# EAGLE design nixie_drive (EAGLE 9.4.2)

## Sheet 1 of 2
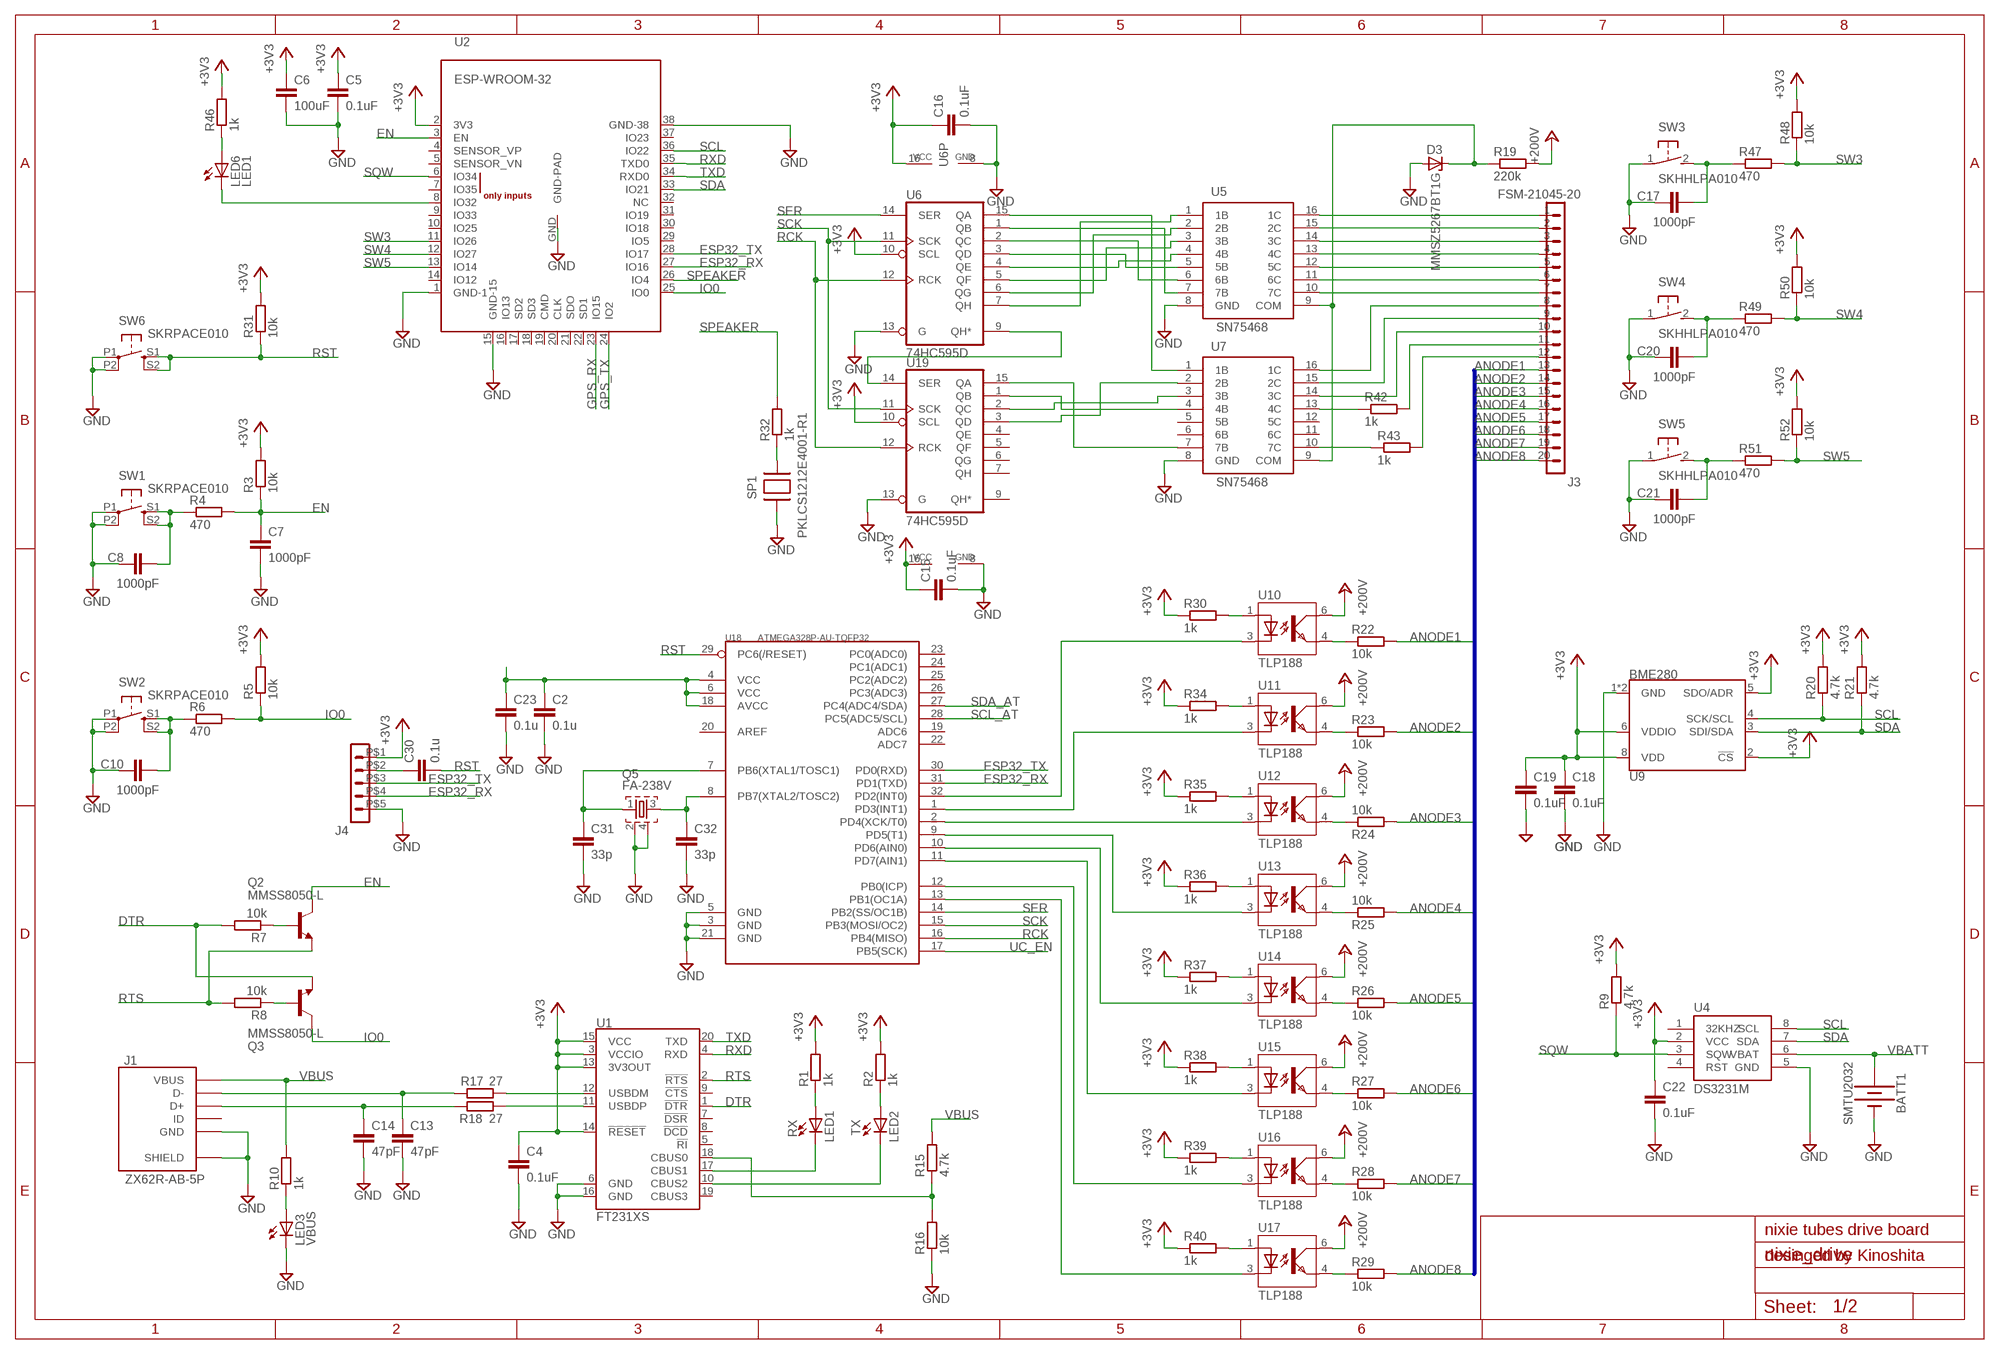
[diagram p0: schematic, sheet 1]

### Parts
BATT1  SMTU2032  [SMTU2032]
C2  0.1u  C-EUC0603  [C0603]
C4  0.1uF  C-EUC0603  [C0603]
C5  0.1uF  C-EUC0603  [C0603]
C6  100uF  C-EUC1210  [C1210]
C7  1000pF  C-EUC0603  [C0603]
C8  1000pF  C-EUC0603  [C0603]
C10  1000pF  C-EUC0603  [C0603]
C13  47pF  C-EUC0603  [C0603]
C14  47pF  C-EUC0603  [C0603]
C15  0.1uF  C-EUC0603  [C0603]
C16  0.1uF  C-EUC0603  [C0603]
C17  1000pF  C-EUC0603  [C0603]
C18  0.1uF  C-EUC0603  [C0603]
C19  0.1uF  C-EUC0603  [C0603]
C20  1000pF  C-EUC0603  [C0603]
C21  1000pF  C-EUC0603  [C0603]
C22  0.1uF  C-EUC0603  [C0603]
C23  0.1u  C-EUC0603  [C0603]
C30  0.1u  C-EUC0603  [C0603]
C31  33p  C-EUC0603  [C0603]
C32  33p  C-EUC0603  [C0603]
D3  MMSZ5267BT1G  [SOD123]
J1  ZX62R-AB-5P  [ZX62R-B-5PA]
J3  FSM-21045-20  [FSM-21045-20]
J4  PIN_HEADER_MALE_1X05_05P  [PIN_HEADER_MALE_1X05_05P]
LED1  RX  LEDCHIPLED_0603  [CHIPLED_0603]
LED2  TX  LEDCHIPLED_0603  [CHIPLED_0603]
LED3  VBUS  LEDCHIPLED_0603  [CHIPLED_0603]
LED6  LED1  LEDCHIPLED_0603  [CHIPLED_0603]
Q2  MMSS8050-L  [SOT23]
Q3  MMSS8050-L  [SOT23]
Q5  FA-238V  [FA238-V]
R1  1k  R-EU_R0603  [R0603]
R2  1k  R-EU_R0603  [R0603]
R3  10k  R-EU_R0603  [R0603]
R4  470  R-EU_R0603  [R0603]
R5  10k  R-EU_R0603  [R0603]
R6  470  R-EU_R0603  [R0603]
R7  10k  R-EU_R0603  [R0603]
R8  10k  R-EU_R0603  [R0603]
R9  4.7k  R-EU_R0603  [R0603]
R10  1k  R-EU_R0603  [R0603]
R15  4.7k  R-EU_R0603  [R0603]
R16  10k  R-EU_R0603  [R0603]
R17  27  R-EU_R0603  [R0603]
R18  27  R-EU_R0603  [R0603]
R19  220k  R-EU_R0603  [R0603]
R20  4.7k  R-EU_R0603  [R0603]
R21  4.7k  R-EU_R0603  [R0603]
R22  10k  R-EU_R3216  [R3216]
R23  10k  R-EU_R3216  [R3216]
R24  10k  R-EU_R3216  [R3216]
R25  10k  R-EU_R3216  [R3216]
R26  10k  R-EU_R3216  [R3216]
R27  10k  R-EU_R3216  [R3216]
R28  10k  R-EU_R3216  [R3216]
R29  10k  R-EU_R3216  [R3216]
R30  1k  R-EU_R0603  [R0603]
R31  10k  R-EU_R0603  [R0603]
R32  1k  R-EU_R0603  [R0603]
R34  1k  R-EU_R0603  [R0603]
R35  1k  R-EU_R0603  [R0603]
R36  1k  R-EU_R0603  [R0603]
R37  1k  R-EU_R0603  [R0603]
R38  1k  R-EU_R0603  [R0603]
R39  1k  R-EU_R0603  [R0603]
R40  1k  R-EU_R0603  [R0603]
R42  1k  R-EU_R0603  [R0603]
R43  1k  R-EU_R0603  [R0603]
R46  1k  R-EU_R0603  [R0603]
R47  470  R-EU_R0603  [R0603]
R48  10k  R-EU_R0603  [R0603]
R49  470  R-EU_R0603  [R0603]
R50  10k  R-EU_R0603  [R0603]
R51  470  R-EU_R0603  [R0603]
R52  10k  R-EU_R0603  [R0603]
SP1  PKLCS1212E4001-R1  [PKLCS1212E4001-R1]
SW1  SKRPACE010  [SKRPACE010]
SW2  SKRPACE010  [SKRPACE010]
SW3  SKHHLPA010  [SKHHLPA010]
SW4  SKHHLPA010  [SKHHLPA010]
SW5  SKHHLPA010  [SKHHLPA010]
SW6  SKRPACE010  [SKRPACE010]
U1  FT231XS  [SSOP20_L]
U2  ESP-WROOM-32  [ESP-WROOM-32]
U4  DS3231M  [SO08]
U5  SN75468  [R-PDSO-G16]
U6  74HC595D  [SO16]
U7  SN75468  [R-PDSO-G16]
U9  BME280  [LGA-8-2.5X2.5]
U10  TLP188  [11-4M1S]
U11  TLP188  [11-4M1S]
U12  TLP188  [11-4M1S]
U13  TLP188  [11-4M1S]
U14  TLP188  [11-4M1S]
U15  TLP188  [11-4M1S]
U16  TLP188  [11-4M1S]
U17  TLP188  [11-4M1S]
U18  ATMEGA328P-AU-TQFP32  MCU-ATMEGA328P-AU(TQFP32)  [TQFP32-0.8-7X7MM]
U19  74HC595D  [SO16]

### Nets
+3V3 [POWER]: C4.1 C5.1 C6.1 C15.1 C16.1 C18.1 C19.1 C22.1 J4.P$1 R1.2 R2.2 R3.2 R5.2 R9.2 R20.2 R21.2 R30.1 R31.2 R34.1 R35.1 R36.1 R37.1 R38.1 R39.1 R40.1 R46.2 R48.2 R50.2 R52.2 U1.3(VCCIO) U1.13(3V3OUT) U1.14(!RESET) U1.15(VCC) U2.2(3V3) U4.2(VCC) U6.10(SCL) U6.16(VCC) U9.2(!CS) U9.5(SDO/ADR) U9.6(VDDIO) U9.8(VDD) U19.10(SCL) U19.16(VCC) ; also sheet 2
+200V: R19.2 U10.6(COL) U11.6(COL) U12.6(COL) U13.6(COL) U14.6(COL) U15.6(COL) U16.6(COL) U17.6(COL) ; also sheet 2
ANODE1: J3.13 R22.2
ANODE2: J3.14 R23.2
ANODE3: J3.15 R24.2
ANODE4: J3.16 R25.2
ANODE5: J3.17 R26.2
ANODE6: J3.18 R27.2
ANODE7: J3.19 R28.2
ANODE8: J3.20 R29.2
D2_N [diffrencial pair]: R17.2 U1.12(USBDM)
D2_P [diffrencial pair]: R18.2 U1.11(USBDP)
D_N [diffrencial pair]: C13.1 J1.D- R17.1
D_P [diffrencial pair]: C14.1 J1.D+ R18.1
DTR: Q3.E R7.2 U1.1(!DTR)
EN: C7.1 Q2.C R3.1 R4.2 U2.3(EN)
ESP32_RX: J4.P$4 U2.27(IO16) U18.31(PD1(TXD))
ESP32_TX: J4.P$3 U2.28(IO17) U18.30(PD0(RXD))
GND: BATT1.N(-) C2.2 C4.2 C5.2 C6.2 C7.2 C8.1 C10.1 C13.2 C14.2 C15.2 C16.2 C17.1 C18.2 C19.2 C20.1 C21.1 C22.2 C23.2 C31.2 C32.2 D3.A J1.GND J1.SHIELD@1(SHIELD) J1.SHIELD@2(SHIELD) J1.SHIELD@3(SHIELD) J1.SHIELD@4(SHIELD) J4.P$5 LED3.C Q5.2 Q5.4 R16.1 SP1.2 SW1.P1(P) SW1.P2(P1) SW2.P1(P) SW2.P2(P1) SW3.1 SW4.1 SW5.1 SW6.P1(P) SW6.P2(P1) U1.6(GND) U1.16(GND) U2.1(GND-1) U2.15(GND-15) U2.38(GND-38) U2.GND(GND-PAD) U4.5(GND) U5.8(GND) U6.8(GND) U6.13(G) U7.8(GND) U9.1(GND) U9.7(GND) U18.3(GND) U18.5(GND) U18.21(GND) U19.8(GND) U19.13(G) ; also sheet 2
GPS_RX: U2.23(IO15)
GPS_TX: U2.24(IO2)
IO0: Q3.C R5.1 R6.2 U2.25(IO0)
N$1: D3.K(C) R19.1 U5.9(COM) U7.9(COM)
N$2: R15.1 R16.2 U1.18(CBUS0)
N$3: J3.1 U5.16(1C)
N$4: LED1.C U1.17(CBUS1)
N$5: LED2.C U1.10(CBUS2)
N$6: C8.2 R4.1 SW1.S1(S) SW1.S2(S1)
N$7: LED1.A R1.1
N$8: LED2.A R2.1
N$9: Q2.B R7.1
N$10: Q3.B R8.1
N$11: C32.1 Q5.3 U18.8(PB7(XTAL2/TOSC2))
N$12: C10.2 R6.1 SW2.S1(S) SW2.S2(S1)
N$13: LED3.A R10.1
N$17: U6.15(QA) U7.1(1B)
N$22: U5.7(7B) U6.1(QB)
N$25: U5.6(6B) U6.2(QC)
N$26: U5.5(5B) U6.3(QD)
N$27: C31.1 Q5.1 U18.7(PB6(XTAL1/TOSC1))
N$28: R22.1 U10.4(EMIT)
N$29: R23.1 U11.4(EMIT)
N$30: R24.1 U12.4(EMIT)
N$31: R25.1 U13.4(EMIT)
N$32: R26.1 U14.4(EMIT)
N$33: R27.1 U15.4(EMIT)
N$34: R28.1 U16.4(EMIT)
N$35: R29.1 U17.4(EMIT)
N$36: R30.2 U10.1(A)
N$37: R32.1 SP1.1
N$38: U10.3(C) U18.32(PD2(INT0))
N$40: U5.4(4B) U6.4(QE)
N$41: U5.3(3B) U6.5(QF)
N$42: U5.2(2B) U6.6(QG)
N$43: U5.1(1B) U6.7(QH)
N$44: U6.9(QH*) U19.14(SER)
N$45: U7.7(7B) U19.15(QA)
N$46: U7.4(4B) U19.1(QB)
N$47: U7.3(3B) U19.2(QC)
N$48: U7.2(2B) U19.3(QD)
N$50: LED6.C U2.8(IO32)
N$51: R34.2 U11.1(A)
N$52: R35.2 U12.1(A)
N$53: R36.2 U13.1(A)
N$54: R37.2 U14.1(A)
N$55: R38.2 U15.1(A)
N$56: R39.2 U16.1(A)
N$57: R40.2 U17.1(A)
N$58: U11.3(C) U18.1(PD3(INT1))
N$59: U12.3(C) U18.2(PD4(XCK/T0))
N$60: U13.3(C) U18.9(PD5(T1))
N$61: U14.3(C) U18.10(PD6(AIN0))
N$62: U15.3(C) U18.11(PD7(AIN1))
N$63: U16.3(C) U18.12(PB0(ICP))
N$64: U17.3(C) U18.13(PB1(OC1A))
N$65: J3.2 U5.15(2C)
N$66: J3.3 U5.14(3C)
N$67: J3.4 U5.13(4C)
N$68: J3.5 U5.12(5C)
N$69: J3.6 U5.11(6C)
N$70: J3.7 U5.10(7C)
N$71: J3.8 U7.16(1C)
N$72: J3.9 U7.15(2C)
N$73: J3.10 U7.14(3C)
N$74: J3.11 R42.2
N$75: J3.12 R43.2
N$77: C30.1 J4.P$2
N$79: R42.1 U7.13(4C)
N$80: R43.1 U7.10(7C)
N$81 [POWER]: C2.1 C23.1 U18.4(VCC) U18.6(VCC) U18.18(AVCC)
N$86: C20.2 R49.1 SW4.2
N$87: C17.2 R47.1 SW3.2
N$90: C21.2 R51.1 SW5.2
N$94: LED6.A R46.1
RCK: U6.12(RCK) U18.16(PB4(MISO)) U19.12(RCK)
RST: C30.2 R31.1 SW6.S1(S) SW6.S2(S1) U18.29(PC6(/RESET))
RTS: Q2.E R8.2 U1.2(!RTS)
RXD: U1.4(RXD) U2.35(TXD0)
SCK: U6.11(SCK) U18.15(PB3(MOSI/OC2)) U19.11(SCK)
SCL: R20.1 U2.36(IO22) U4.8(SCL) U9.4(SCK/SCL)
SCL_AT: U18.28(PC5(ADC5/SCL)) ; also sheet 2
SDA: R21.1 U2.33(IO21) U4.7(SDA) U9.3(SDI/SDA)
SDA_AT: U18.27(PC4(ADC4/SDA)) ; also sheet 2
SER: U6.14(SER) U18.14(PB2(SS/OC1B))
SPEAKER: R32.2 U2.26(IO4)
SQW: R9.1 U2.6(IO34) U4.3(SQW)
SW3: R47.2 R48.1 U2.11(IO26)
SW4: R49.2 R50.1 U2.12(IO27)
SW5: R51.2 R52.1 U2.13(IO14)
TXD: U1.20(TXD) U2.34(RXD0)
UC_EN: U18.17(PB5(SCK)) ; also sheet 2
VBATT: BATT1.P(+) U4.6(VBAT)
VBUS: J1.VCC(VBUS) R10.2 R15.2
Unconnected: J1.ID U1.5(!RI) U1.7(!DSR) U1.8(!DCD) U1.9(!CTS) U1.19(CBUS3) U2.4(SENSOR_VP) U2.5(SENSOR_VN) U2.7(IO35) U2.9(IO33) U2.10(IO25) U2.14(IO12) U2.16(IO13) U2.17(SD2) U2.18(SD3) U2.19(CMD) U2.20(CLK) U2.21(SDO) U2.22(SD1) U2.29(IO5) U2.30(IO18) U2.31(IO19) U2.32(NC) U2.37(IO23) U4.1(32KHZ) U4.4(RST) U7.5(5B) U7.6(6B) U7.11(6C) U7.12(5C) U18.19(ADC6) U18.20(AREF) U18.22(ADC7) U18.23(PC0(ADC0)) U18.24(PC1(ADC1)) U18.25(PC2(ADC2)) U18.26(PC3(ADC3)) U19.4(QE) U19.5(QF) U19.6(QG) U19.7(QH) U19.9(QH*)

### Buses
ANODE[1..8]

### Notes on the sheet
- nixie tubes drive board
- desinged by Kinoshita

## Sheet 2 of 2
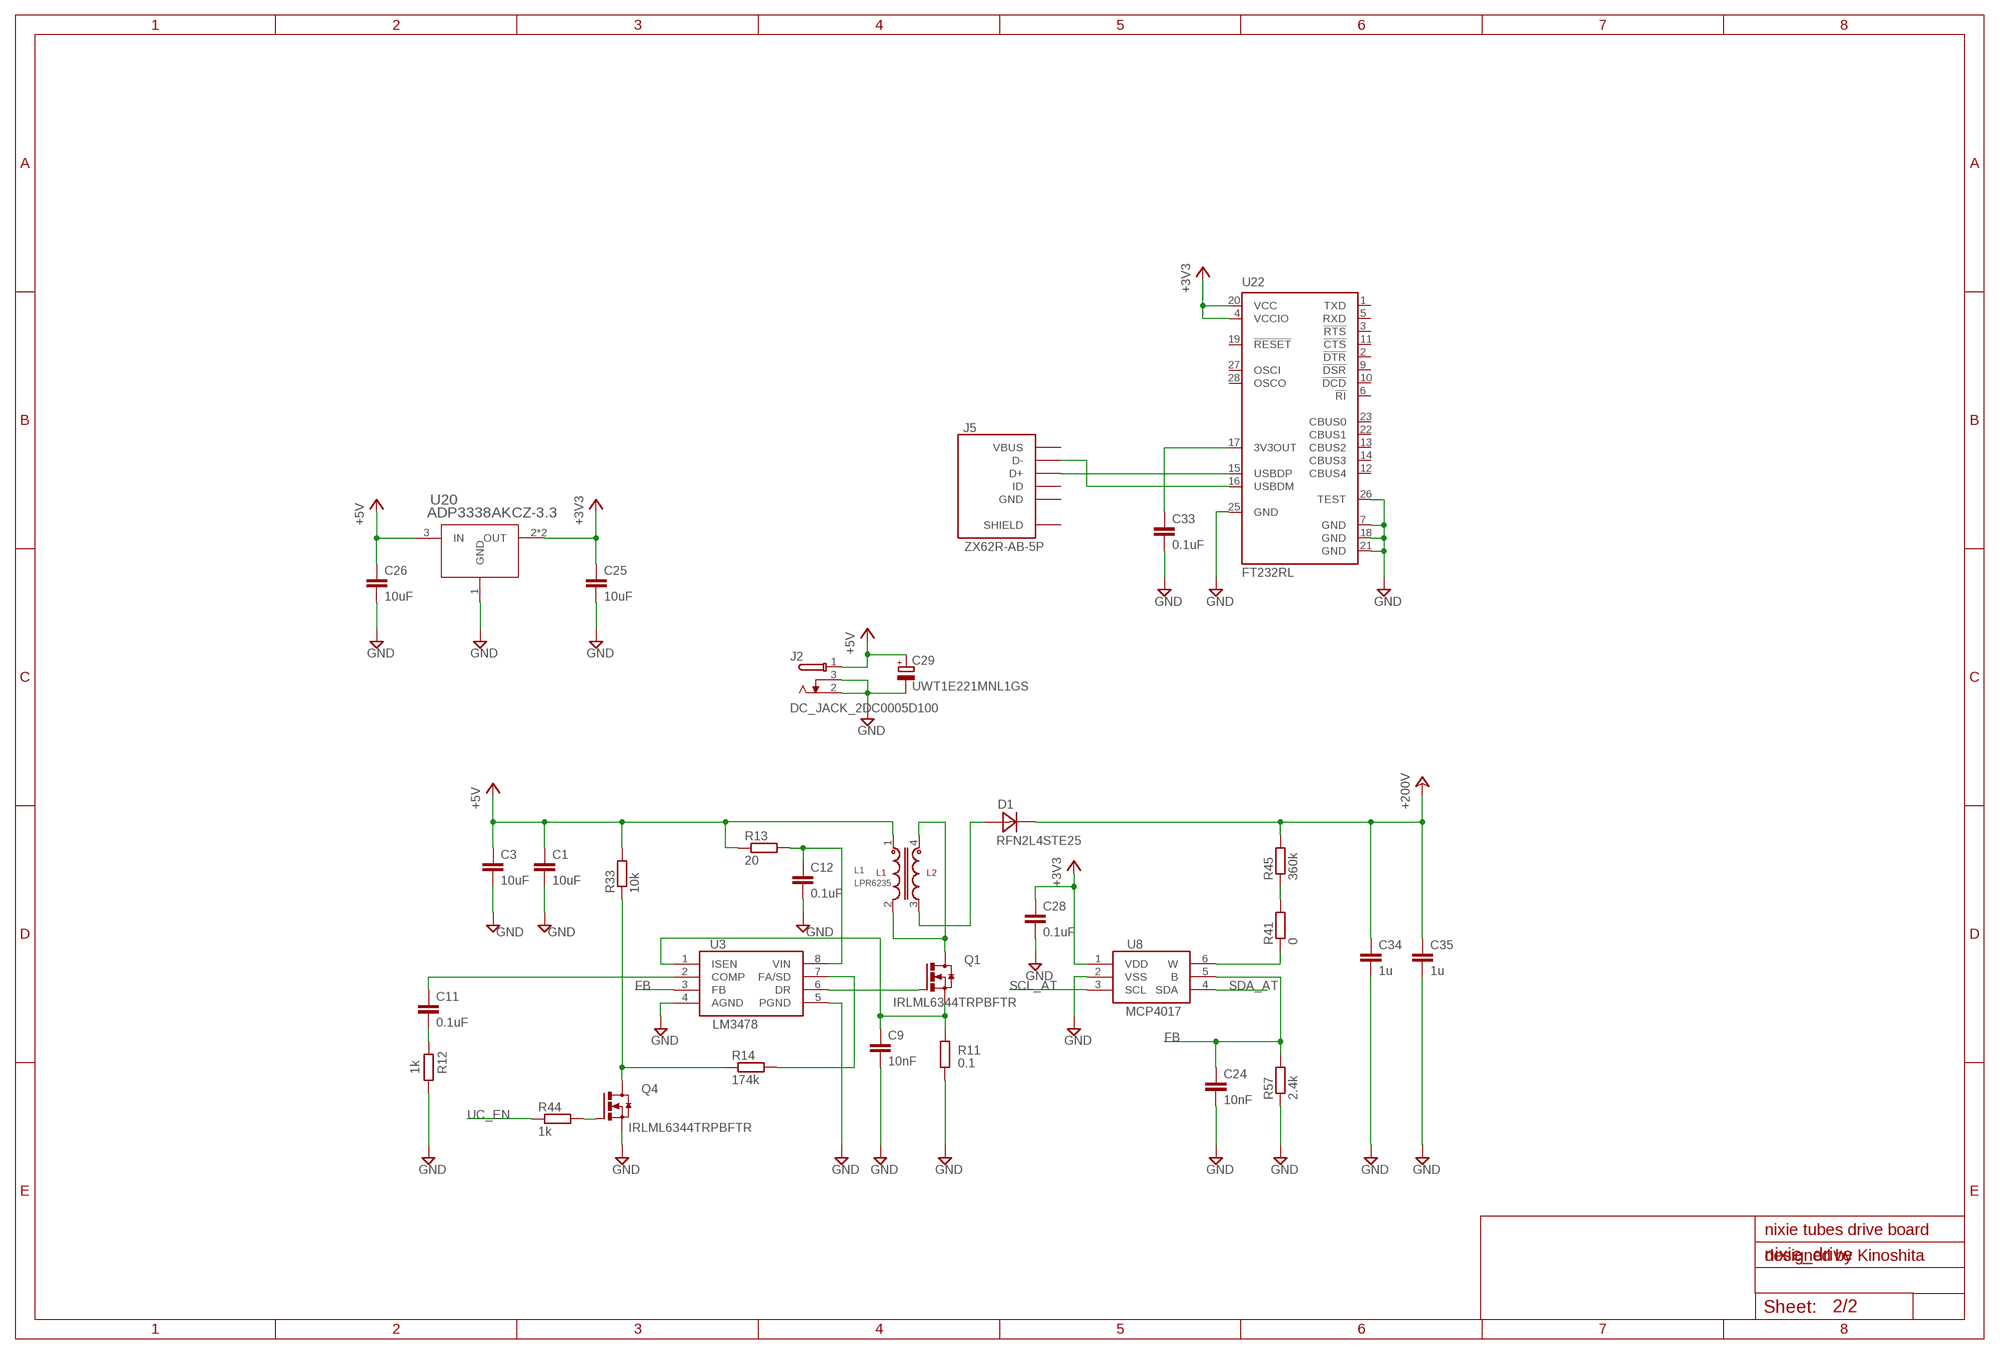
[diagram p1: schematic, sheet 2]

### Parts
C1  10uF  C-EUC0603  [C0603]
C3  10uF  C-EUC0603  [C0603]
C9  10nF  C-EUC0603  [C0603]
C11  0.1uF  C-EUC0603  [C0603]
C12  0.1uF  C-EUC0603  [C0603]
C24  10nF  C-EUC0603  [C0603]
C25  10uF  C-EUC0603  [C0603]
C26  10uF  C-EUC0603  [C0603]
C28  0.1uF  C-EUC0603  [C0603]
C29  UWT1E221MNL1GS  [NICHICON-ALMINUM-CAPACITOR-8MM]
C33  0.1uF  C-EUC0603  [C0603]
C34  1u  C-EU  [C5750]
C35  1u  C-EU  [C5750]
D1  RFN2L4STE25  [SOD-106]
J2  DC_JACK_2DC0005D100  [DC_JACK_2DC0005D100]
J5  ZX62R-AB-5P  [ZX62R-B-5PA]
L1  LPR6235  [LPR6235]
Q1  IRLML6344TRPBFTR  [SOT23-N-MOSFET]
Q4  IRLML6344TRPBFTR  [SOT23-N-MOSFET]
R11  0.1  R-EU_R0603  [R0603]
R12  1k  R-EU_R0603  [R0603]
R13  20  R-EU_R0603  [R0603]
R14  174k  R-EU_R0603  [R0603]
R33  10k  R-EU_R0603  [R0603]
R41  0  R-EU_R0603  [R0603]
R44  1k  R-EU_R0603  [R0603]
R45  360k  R-EU_R0603  [R0603]
R57  2.4k  R-EU_R0603  [R0603]
U3  LM3478  [SOIC8-LT]
U8  MCP4017  [SC-70-MICROCHIP]
U20  ADP3338AKCZ-3.3  [SOT233]
U22  FT232RL  [SSOP28]

### Nets
+3V3 [POWER]: C25.1 C28.1 U8.1(VDD) U20.2(OUT) U20.4(OUT) U22.4(VCCIO) U22.20(VCC) ; also sheet 1
+5V: C1.1 C3.1 C26.1 C29.POS(+) J2.1 L1.1 R13.1 R33.2 U20.3(IN)
+200V: C34.1 C35.1 D1.K(C) R45.2 ; also sheet 1
FB: C24.1 R57.2 U3.3(FB) U8.5(B)
GND: C1.2 C3.2 C9.2 C12.2 C24.2 C25.2 C26.2 C28.2 C29.NEG(-) C33.2 C34.2 C35.2 J2.2 J2.3 Q4.S R11.1 R12.1 R57.1 U3.4(AGND) U3.5(PGND) U8.2(VSS) U20.1(GND) U22.7(GND) U22.18(GND) U22.21(GND) U22.25(GND) U22.26(TEST) ; also sheet 1
N$14: L1.2 L1.4 Q1.D
N$15: C11.1 U3.2(COMP)
N$16: R14.2 U3.7(FA/SD)
N$18: D1.A L1.3
N$19: Q1.G U3.6(DR)
N$20: C9.1 Q1.S R11.2 U3.1(ISEN)
N$21: C11.2 R12.2
N$23: C12.1 R13.2 U3.8(VIN)
N$24: Q4.D R14.1 R33.1
N$39: Q4.G R44.2
N$49: R41.1 U8.6(W)
N$76: R41.2 R45.1
N$78: C33.1 U22.17(3V3OUT)
N$82: J5.D+ U22.15(USBDP)
N$83: J5.D- U22.16(USBDM)
SCL_AT: U8.3(SCL) ; also sheet 1
SDA_AT: U8.4(SDA) ; also sheet 1
UC_EN: R44.1 ; also sheet 1
Unconnected: J5.GND J5.ID J5.SHIELD@1(SHIELD) J5.SHIELD@2(SHIELD) J5.SHIELD@3(SHIELD) J5.SHIELD@4(SHIELD) J5.VCC(VBUS) U22.1(TXD) U22.2(!DTR) U22.3(!RTS) U22.5(RXD) U22.6(!RI) U22.9(!DSR) U22.10(!DCD) U22.11(!CTS) U22.12(CBUS4) U22.13(CBUS2) U22.14(CBUS3) U22.19(!RESET) U22.22(CBUS1) U22.23(CBUS0) U22.27(OSCI) U22.28(OSCO)

### Notes on the sheet
- nixie tubes drive board
- designed by Kinoshita

## Library data of the parts
BATT1 = taki-library:SMTU2032
C1-C26 C28 C30-C35 = taki-library:C-EU: CAPACITOR, European symbol
C29 = taki-library:UWT1E221MNL1GS
D1 = taki-library:RFN2L4STE25
D3 = taki-library:MMSZ5267BT1G
J1 J5 = taki-library:ZX62
J2 = taki-library:DC_JACK_2DC0005D100: AKIZUKIDENSHI 2DC-0005D100 SINGATRON ENTERPRISE CO., LTD http://akizukidenshi.com/download/2DC-0005D100.pdf
J3 = taki-library:FSM-21045-20
J4 = taki-library:PIN_HEADER_MALE_1X05_05P
L1 = taki-library:LPR6235
LED1-LED3 LED6 = taki-library:LED: LED OSRAM: - CHIPLED LG R971, LG N971, LY N971, LG Q971, LY Q971, LO R971, LY R971 LH N974, LH R974 LS Q976, LO Q976, LY Q976 LO Q996 - Hyper CHIPLED LW Q18S LB Q993, LB Q99A, LB R99A - SideLED LS A670, LO A670, LY A670, LG A670, LP A670 LB A673, LV A673, LT A673, LW A673 LH A674 LY A675 LS A676, LA A676, LO A676, LY A676, LW A676 LS A679, LY A679, LG A679 - Hyper Micro SIDELED® LS Y876, LA Y876, LO Y876, LY Y876 LT Y87S - SmartLED LW L88C, LW L88S LB L89C, LB L89S, LG L890 LS L89K, LO L89K, LY L89K LS L896, LA L896, LO L896, LY L896 - TOPLED LS T670, LO T670, LY T670, LG T670, LP T670 LSG T670, LSP T670, LSY T670, LOP T670, LYG T670 LG T671, LOG T671, LSG T671 LB T673, LV T673, LT T673, LW T673 LH T674 LS T676, LA T676, LO T676, LY T676, LB T676, LH T676, LSB T676, LW T676 LB T67C, LV T67C, LT T67C, LS T67K, LO T67K, LY T67K, LW E67C LS E67B, LA E67B, LO E67B, LY E67B, LB E67C, LV E67C, LT E67C LW T67C LS T679, LY T679, LG T679 LS T770, LO T770, LY T770, LG T770, LP T770 LB T773, LV T773, LT T773, LW T773 LH T774 LS E675, LA E675, LY E675, LS T675 LS T776, LA T776, LO T776, LY T776, LB T776 LHGB T686 LT T68C, LB T68C - Hyper Mini TOPLED® LB M676 - Mini TOPLED Santana® LG M470 LS M47K, LO M47K, LY M47K Source: http://www.osram.convergy.de LUXEON: - LUMILED® LXK2-PW12-R00, LXK2-PW12-S00, LXK2-PW14-U00, LXK2-PW14-V00 LXK2-PM12-R00, LXK2-PM12-S00, LXK2-PM14-U00 LXK2-PE12-Q00, LXK2-PE12-R00, LXK2-PE12-S00, LXK2-PE14-T00, LXK2-PE14-U00 LXK2-PB12-K00, LXK2-PB12-L00, LXK2-PB12-M00, LXK2-PB14-N00, LXK2-PB14-P00, LXK2-PB14-Q00 LXK2-PR12-L00, LXK2-PR12-M00, LXK2-PR14-Q00, LXK2-PR14-R00 LXK2-PD12-Q00, LXK2-PD12-R00, LXK2-PD12-S00 LXK2-PH12-R00, LXK2-PH12-S00 LXK2-PL12-P00, LXK2-PL12-Q00, LXK2-PL12-R00 Source: www.luxeon.com KINGBRIGHT: KA-3528ASYC Source: www.kingbright.com
Q1 Q4 = taki-library:IRLML6344TRPBFTR
Q2 Q3 = taki-library:MMSS8050: Bipolar (BJT) Transistor NPN 25V 1.5A 100MHz 625mW Surface Mount SOT-23; DIGIKEY_URL: https://www.digikey.jp/product-detail/ja/micro-commercial-co/MMSS8050-L-TP/MMSS8050-L-TPMSCT-ND/2827203; MARUTSU_URL: https://www.marutsu.co.jp/pc/i/15861860/; STORE: MARUTSU; URL: https://www.marutsu.co.jp/pc/i/15861860/
Q5 = taki-library:FA-238V
R1-R29 R31-R33 R41 R44-R52 R57 = taki-library:R-EU_: RESISTOR, European symbol
R30 R34-R40 R42 R43 = 180118 Library by matsu:R-EU_: RESISTOR, European symbol
SP1 = taki-library:PKLCS1212E4001-R1
SW1 SW2 SW6 = taki-library:SKRPACE010
SW3-SW5 = taki-library:SKHHLPA010
U1 = taki-library:FT231X: FTDI FT231X Full Speed USB to Full-handshake UART This USB2.0 Full Speed IC offers a compact bridge to full handshake UART interfaces. The device is a UART, capable of operating up to 3MBaud, with low power consumption (8mA). The FT231X includes the complete FT-X series feature set and enables USB to be added into a system design quickly and easily over a UART interface. Datasheet <http://cdn.sparkfun.com/datasheets/Components/General%20IC/DS_FT231X.pdf> SparkFun Products SparkFun RedBoard - Programmed with Arduino <https://www.sparkfun.com/products/12757> (DEV-12757) SparkFun XBee Explorer USB <https://www.sparkfun.com/products/11812> (WRL-11812) SparkFun XBee Explorer Dongle <https://www.sparkfun.com/products/11697> (WRL-11697) SparkFun Blynk Board - ESP8266 <https://www.sparkfun.com/products/13794> (WRL-13794) SparkFun ESP8266 Thing - Dev Board <https://www.sparkfun.com/products/13711> (WRL-13711) SparkFun Block for Intel® Edison - Base <https://www.sparkfun.com/products/13045> (DEV-13045) SparkFun RedStick <https://www.sparkfun.com/products/13741> (DEV-13741) SparkFun Beefy 3 - FTDI Basic Breakout <https://www.sparkfun.com/products/13746> (DEV-13746) SparkFun FT231X Breakout <https://www.sparkfun.com/products/11736> (BOB-11736); PROD_ID: IC-11524
U2 = taki-library:ESP-WROOM-32
U3 = taki-library:LM3478
U4 = taki-library:DS3231M: DS3231M Real Time Clock Accuracy +/-5ppm. Battery Backup. 2.3V to 5.5V. Datasheet <https://cdn.sparkfun.com/datasheets/Dev/Beagle/DS3231M.pdf> SparkFun Products CryptoCape <https://www.sparkfun.com/products/12773> (DEV-12773) SparkFun CryptoShield <https://www.sparkfun.com/products/13183> (DEV-13183); PROD_ID: IC-11985
U5 U7 = taki-library:SN75468
U6 U19 = taki-library:74*595: 8-bit SHIFT REGISTER, output latch
U8 = taki-library:MCP4017
U9 = taki-library:BME280: Bosch BME280 – Combined Humidity and Pressure Sensor The BME280 is as combined digital humidity, pressure and temperature sensor based on proven sensing principles. The sensor module is housed in an extremely compact metal-lid LGA package with a footprint of only 2.5×2.5mm² with a height of 0.93mm. Its small dimensions and its low power consumption allow the implementation in battery driven devices such as handsets, GPS modules or watches. Datasheet <https://cdn.sparkfun.com/assets/learn_tutorials/4/1/9/BST-BME280_DS001-10.pdf> SparkFun Products SparkFun Atmospheric Sensor Breakout - BME280 <https://www.sparkfun.com/products/13676> (SEN-13676); PROD_ID: IC-13090
U10-U17 = taki-library:TLP188
U18 = taki-library:MCU-ATMEGA328P-AU(TQFP32): 310010049; MPN: ATMEGA328P-AU
U20 = taki-library:ADP3338AKCZ-3.3
U22 = taki-library:FT232R: Source: http://www.ftdichip.com/Documents/DataSheets/DS_FT232R_v104.pdf; MPN: FT232RL; OC_FARNELL: 1146032; OC_NEWARK: 91K9918

## Net classes
0 default: width 0.152 mm
1 POWER: width 0.152 mm
2 diffrencial pair: width 0.15 mm, clearance 0.3 mm to class 0, clearance 0.3 mm to class 1, clearance 0.15 mm
3 3pin digital: width 0.15 mm
4 high-voltage: width 0.3 mm, clearance 0.7 mm to class 0, clearance 0.7 mm to class 1, clearance 0.7 mm to class 2, clearance 0.7 mm to class 3, clearance 0.7 mm

## Board
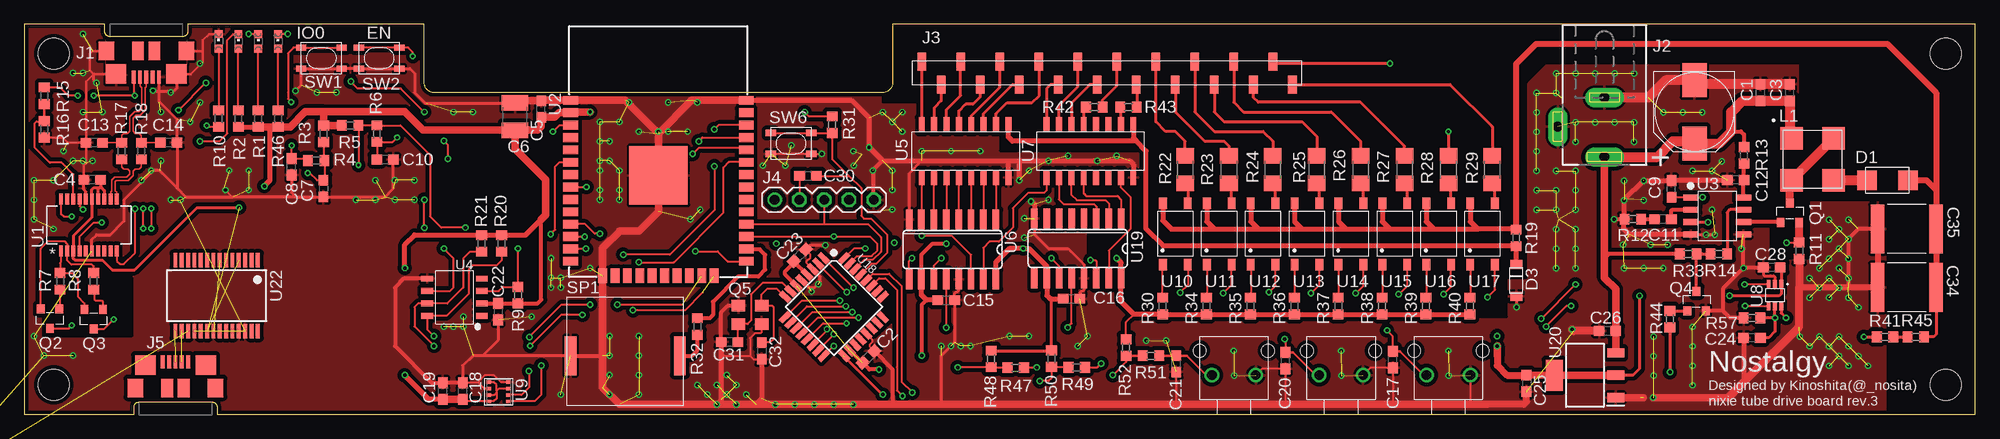
[diagram p2: board, top side]
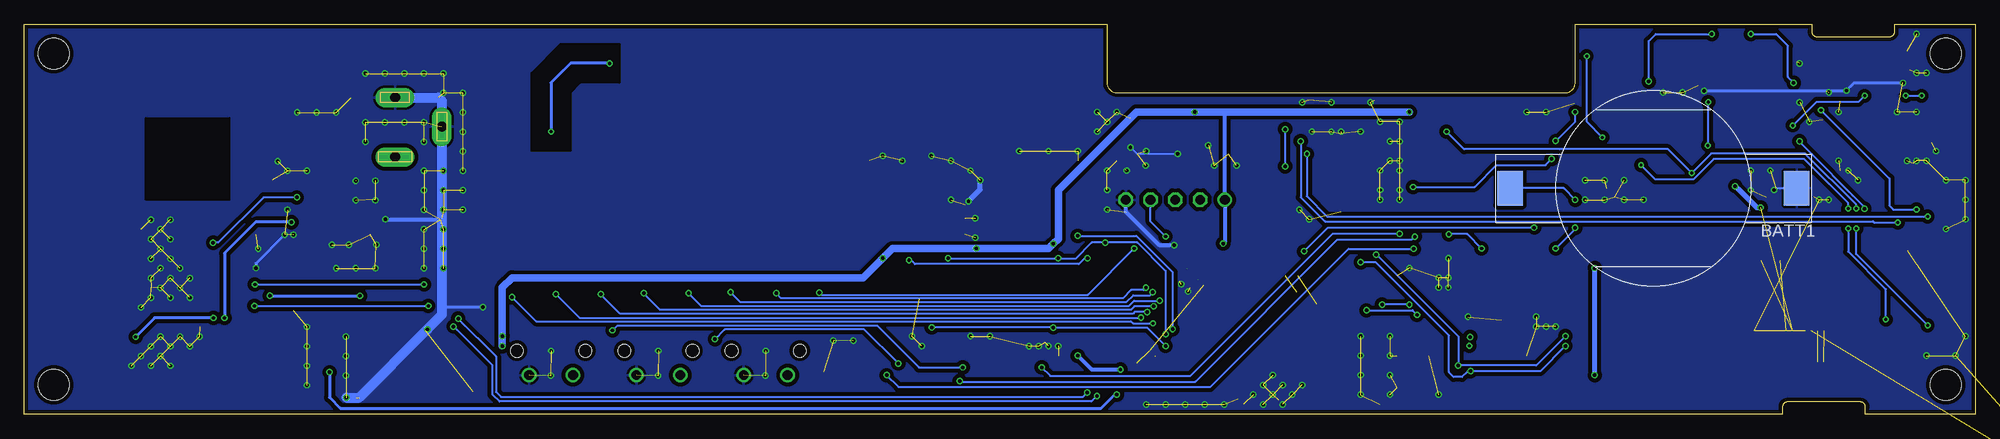
[diagram p3: board, bottom side, seen from below]

Size 200 x 40 mm. Coordinates in mm from the lower left corner, seen from the top.
Outline: 200,0 200,40 89,40 89,34 arc-90 88,33 42,33 arc-90 41,34 41,40 16.75,40 16.75,39.25 arc-90 16.25,38.75 8.75,38.75 arc-90 8.25,39.25 8.25,40 0,40 0,0 11.25,0 11.25,0.75 arc-90 11.75,1.25 19.25,1.25 arc-90 19.75,0.75 19.75,0 200,0
Copper layers (1*16): Top 0.035mm / dielectric 1.6mm / Bottom 0.035mm
Design rules "Elecrow_2-layer_PCB_eagle_rule *": minimum track width 6mil, minimum drill 12mil, track to track 6mil, track to pad 6mil, pad to pad 6mil, via to via 8mil, smd to smd 0mil, copper to edge 10mil, drill to drill 10mil, minimum pad ring 6mil, minimum via ring 6mil, stop-mask expansion 0mil, vias tented up to drill 100mil, thermal gap 10mil
Holes 3.2 mm at 3,37 3,3 197,37 197,3

### Footprints (pad centres in the part's own frame; a part is rotated, then mirrored left to right if it is on the bottom)
SMTU2032 = smd 2.6 x 3.5: N 14.7,0; P -14.7,0
C0603 = smd 1.1 x 1: 1 -0.85,0; 2 0.85,0
C1210 = smd 1.6 x 2.7: 1 -1.4,0; 2 1.4,0
NICHICON-ALMINUM-CAPACITOR-8MM = smd 2.5 x 3.5: NEG 0,-3.25; POS 0,3.25
C5750 = smd 1.4 x 5: 1 -3,0; 2 3,0
SOD-106 = smd 2 x 2: A 0,-2.1; K 0,2.1
SOD123 = smd 0.91 x 1.22: A -1.635,0; K 1.635,0
ZX62R-B-5PA = smd 0.4 x 1.35: D+ 0,2.675; D- 0.65,2.675; GND -1.3,2.675; ID -0.65,2.675; VCC 1.3,2.675 | smd 1.2 x 1.9: NC@1 -0.85,0; NC@2 0.85,0 | smd 2.1 x 2: SHIELD@1 -3.1,2.35; SHIELD@2 3.1,2.35 | smd 1.6 x 1.9: SHIELD@3 -4.1,0; SHIELD@4 4.1,0
DC_JACK_2DC0005D100 = drill 1 pad 2 long: 1 -3.1,0; 2 3,0; 3 0,4.8
FSM-21045-20 = smd 0.89 x 1.85: 1 0,1.175; 2 2,-1.175; 3 4,1.175; 4 6,-1.175; 5 8,1.175; 6 10,-1.175; 7 12,1.175; 8 14,-1.175; 9 16,1.175; 10 18,-1.175; 11 20,1.175; 12 22,-1.175; 13 24,1.175; 14 26,-1.175; 15 28,1.175; 16 30,-1.175; 17 32,1.175; 18 34,-1.175; 19 36,1.175; 20 38,-1.175
PIN_HEADER_MALE_1X05_05P = drill 1: P$1 -5.08,0 | drill 1 octagon: P$2 -2.54,0; P$3 0,0; P$4 2.54,0; P$5 5.08,0
LPR6235 = smd 2.3 x 2.3: 1 -2.15,2.15; 2 -2.15,-2.15; 3 2.15,-2.15; 4 2.15,2.15
CHIPLED_0603 = smd 0.8 x 0.8: A 0,-0.75; C 0,0.75
SOT23-N-MOSFET = smd 0.8 x 0.9: D 0,1; G -0.95,-1; S 0.95,-1
SOT23 = smd 0.8 x 0.9: B -0.95,-1; C 0,1; E 0.95,-1
FA238-V = smd 1.4 x 1.2: 1 -1.2,-0.95; 2 1.2,-0.95; 3 1.2,0.95; 4 -1.2,0.95
R0603 = smd 1 x 1.1: 1 -0.85,0; 2 0.85,0
R3216 = smd 1.6 x 1.8: 1 -1.4,0; 2 1.4,0
PKLCS1212E4001-R1 = smd 1.2 x 4: 1 11.2,0; 2 0,0
SKRPACE010 = smd 1.05 x 0.65: P1 -2.075,-1.075; P2 2.075,-1.075; S1 -2.075,1.075; S2 2.075,1.075
SKHHLPA010 = drill 1: 1 2.25,0; 2 -2.25,0 | hole 1.3: -3.5,2.5; 3.5,2.5
SSOP20_L = smd 0.4 x 1.143: 1 -2.857,-2.68; 2 -2.223,-2.68; 3 -1.587,-2.68; 4 -0.953,-2.68; 5 -0.318,-2.68; 6 0.318,-2.68; 7 0.953,-2.68; 8 1.587,-2.68; 9 2.223,-2.68; 10 2.857,-2.68; 11 2.857,2.68; 12 2.223,2.68; 13 1.587,2.68; 14 0.953,2.68; 15 0.318,2.68; 16 -0.318,2.68; 17 -0.953,2.68; 18 -1.587,2.68; 19 -2.223,2.68; 20 -2.857,2.68
ESP-WROOM-32 = smd 0.9 x 1.5: 1 7.7,9; 2 6.43,9; 3 5.16,9; 4 3.89,9; 5 2.62,9; 6 1.35,9; 7 0.08,9; 8 -1.19,9; 9 -2.46,9; 10 -3.73,9; 11 -5,9; 12 -6.27,9; 13 -7.54,9; 14 -8.81,9; 25 -8.81,-9; 26 -7.54,-9; 27 -6.27,-9; 28 -5,-9; 29 -3.73,-9; 30 -2.46,-9; 31 -1.19,-9; 32 0.08,-9; 33 1.35,-9; 34 2.62,-9; 35 3.89,-9; 36 5.16,-9; 37 6.43,-9; 38 7.7,-9 | smd 1.5 x 0.9: 15 -10.3,5.715; 16 -10.3,4.445; 17 -10.3,3.175; 18 -10.3,1.905; 19 -10.3,0.635; 20 -10.3,-0.635; 21 -10.3,-1.905; 22 -10.3,-3.175; 23 -10.3,-4.445; 24 -10.3,-5.715 | smd 6 x 6: GND 0,0
SOIC8-LT = smd 1.55 x 0.6: 1 -2.7,1.905; 2 -2.7,0.635; 3 -2.7,-0.635; 4 -2.7,-1.905; 5 2.7,-1.905; 6 2.7,-0.635; 7 2.7,0.635; 8 2.7,1.905
SO08 = smd 0.6 x 1.2: 1 -1.905,-2.8; 2 -0.635,-2.8; 3 0.635,-2.8; 4 1.905,-2.8; 5 1.905,2.8; 6 0.635,2.8; 7 -0.635,2.8; 8 -1.905,2.8
R-PDSO-G16 = smd 0.6 x 1.55: 1 0,-2.7; 2 1.27,-2.7; 3 2.54,-2.7; 4 3.81,-2.7; 5 5.08,-2.7; 6 6.35,-2.7; 7 7.62,-2.7; 8 8.89,-2.7; 9 8.89,2.7; 10 7.62,2.7; 11 6.35,2.7; 12 5.08,2.7; 13 3.81,2.7; 14 2.54,2.7; 15 1.27,2.7; 16 0,2.7
SO16 = smd 0.66 x 2.032: 1 -4.445,-3.073; 2 -3.175,-3.073; 3 -1.905,-3.073; 4 -0.635,-3.073; 5 0.635,-3.073; 6 1.905,-3.073; 7 3.175,-3.073; 8 4.445,-3.073; 9 4.445,3.073; 10 3.175,3.073; 11 1.905,3.073; 12 0.635,3.073; 13 -0.635,3.073; 14 -1.905,3.073; 15 -3.175,3.073; 16 -4.445,3.073
SC-70-MICROCHIP = smd 0.4 x 0.9: 1 0,-1.1; 2 0.65,-1.1; 3 1.3,-1.1; 4 1.3,1.1; 5 0.65,1.1; 6 0,1.1
LGA-8-2.5X2.5 = smd 0.35 x 0.5: 1 -0.975,1.025; 2 -0.325,1.025; 3 0.325,1.025; 4 0.975,1.025; 5 0.975,-1.025; 6 0.325,-1.025; 7 -0.325,-1.025; 8 -0.975,-1.025
11-4M1S = smd 1.2 x 0.8: 1 -3.15,1.27; 3 -3.15,-1.27; 4 3.15,-1.27; 6 3.15,1.27
TQFP32-0.8-7X7MM = smd 1.27 x 0.559: 1 -4.293,2.8; 2 -4.293,2; 3 -4.293,1.2; 4 -4.293,0.4; 5 -4.293,-0.4; 6 -4.293,-1.2; 7 -4.293,-2; 8 -4.293,-2.8; 17 4.293,-2.8; 18 4.293,-2; 19 4.293,-1.2; 20 4.293,-0.4; 21 4.293,0.4; 22 4.293,1.2; 23 4.293,2; 24 4.293,2.8 | smd 0.559 x 1.27: 9 -2.8,-4.293; 10 -2,-4.293; 11 -1.2,-4.293; 12 -0.4,-4.293; 13 0.4,-4.293; 14 1.2,-4.293; 15 2,-4.293; 16 2.8,-4.293; 25 2.8,4.293; 26 2,4.293; 27 1.2,4.293; 28 0.4,4.293; 29 -0.4,4.293; 30 -1.2,4.293; 31 -2,4.293; 32 -2.8,4.293
SOT233 = smd 1.75 x 0.95: 1 -3.15,2.3; 2 -3.15,0; 3 -3.15,-2.3 | smd 1.75 x 3.2: 4 3.15,0
SSOP28 = smd 0.4 x 1.5: 1 -4.225,-3.625; 2 -3.575,-3.625; 3 -2.925,-3.625; 4 -2.275,-3.625; 5 -1.625,-3.625; 6 -0.975,-3.625; 7 -0.325,-3.625; 8 0.325,-3.625; 9 0.975,-3.625; 10 1.625,-3.625; 11 2.275,-3.625; 12 2.925,-3.625; 13 3.575,-3.625; 14 4.225,-3.625; 15 4.225,3.625; 16 3.575,3.625; 17 2.925,3.625; 18 2.275,3.625; 19 1.625,3.625; 20 0.975,3.625; 21 0.325,3.625; 22 -0.325,3.625; 23 -0.975,3.625; 24 -1.625,3.625; 25 -2.275,3.625; 26 -2.925,3.625; 27 -3.575,3.625; 28 -4.225,3.625

### Placement (x,y rotation side)
BATT1  32.99,23.19 0 bottom
C1  178,33 90 top
C2  86.54,5.88 45 top
C3  181,33 90 top
C4  6.96,24.05 180 top
C5  52.99,31.31 90 top
C6  50.3,30.53 90 top
C7  30.66,23.15 270 top
C8  27.4,25.38 90 top
C9  168.87,23.12 90 top
C10  36.98,26.12 180 top
C11  168,20 180 top
C12  175.45,24.03 180 top
C13  7.17,27.85 180 top
C14  14.81,27.87 0 top
C15  94.5,11.7 0 top
C16  107.36,11.85 0 top
C17  140.3,5.6 90 top
C18  44.95,2.38 90 top
C19  42.91,2.38 90 top
C20  129.3,5.5 90 top
C21  118.09,5.17 90 top
C22  48.57,10.52 270 top
C23  79.5,16.3 45 top
C24  177.12,7.83 180 top
C25  154,3.17 270 top
C26  162.3,8.54 180 top
C28  179.14,15.06 180 top
C29  171.23,31.02 180 top
C30  80.33,24.46 0 top
C31  72.3,7.4 180 top
C32  75.6,6.5 270 top
C33  -13,-10 0 top  (outside the outline)
C34  193,13 180 top
C35  193,19 180 top
D1  191,24 270 top
D3  152.95,13.71 90 top
J1  12.5,37.25 180 top
J2  162,29.5 90 top
J3  92,35 0 top
J4  82,22 0 top
J5  15.49,2.7 0 top
L1  183.33,26.15 0 top
LED1  23.98,38.25 0 top
LED2  21.95,38.25 0 top
LED3  19.91,38.26 0 top
LED6  26.01,38.25 0 top
Q1  181,20.67 0 top
Q2  2.63,9.79 180 top
Q3  7.1,9.74 180 top
Q4  171.43,11.61 0 top
Q5  74.4,10.2 0 top
R1  23.98,30.32 270 top
R2  21.95,30.32 270 top
R3  30.68,28.76 90 top
R4  29.92,26.02 0 top
R5  33.4,29.62 180 top
R6  36.14,28.79 90 top
R7  3.66,13.63 90 top
R8  7.11,13.63 90 top
R9  50.6,12.22 270 top
R10  19.91,30.34 270 top
R11  181.96,16.77 90 top
R12  164.91,20.01 0 top
R13  176.3,26.56 270 top
R14  173.73,16.44 0 top
R15  2.03,32.67 90 top
R16  2.03,29.22 90 top
R17  9.97,27 270 top
R18  12,27 270 top
R19  152.94,18.09 90 top
R20  48.92,17.52 90 top
R21  46.87,17.52 90 top
R22  119,25.1 90 top
R23  123.5,25.1 90 top
R24  128,25.1 90 top
R25  132.5,25.1 90 top
R26  137,25.1 90 top
R27  141.5,25.1 90 top
R28  146,25.1 90 top
R29  150.5,25.1 90 top
R30  116.7,11.1 90 top
R31  82.82,29.7 90 top
R32  69,9 90 top
R33  170.58,16.45 180 top
R34  121.2,11.1 90 top
R35  125.7,11.1 90 top
R36  130.2,11.1 90 top
R37  134.7,11.1 90 top
R38  139.2,11.1 90 top
R39  143.7,11.1 90 top
R40  148.2,11.1 90 top
R41  190.76,7.93 0 top
R42  109.7,31.5 0 top
R43  113.2,31.5 0 top
R44  168.71,9.76 90 top
R45  193.92,7.94 0 top
R46  26.01,30.32 270 top
R47  101.64,4.77 180 top
R48  99.12,5.67 90 top
R49  107.9,4.8 180 top
R50  105.3,5.7 90 top
R51  115.5,6 180 top
R52  112.96,6.83 90 top
R57  177.12,9.88 0 top
SP1  56,6 0 top
SW1  30.45,36.53 0 top
SW2  36.37,36.53 0 top
SW3  146,4 0 top
SW4  135,4 0 top
SW5  124,4 0 top
SW6  78.61,27.78 0 top
U1  6.61,19.41 0 top
U2  65,24.5 90 top
U3  173.56,20.34 0 top
U4  44.1,12 90 top
U5  92,27 0 top
U6  95.15,16.9 180 top
U7  104.8,27 0 top
U8  180.12,12.21 180 top
U9  48.64,2.3 270 top
U10  118,18.5 90 top
U11  122.5,18.5 90 top
U12  127,18.5 90 top
U13  131.5,18.5 90 top
U14  136,18.5 90 top
U15  140.5,18.5 90 top
U16  145,18.5 90 top
U17  149.5,18.5 90 top
U18  83,11 315 top
U19  108,17 180 top
U20  160,4 180 top
U22  19.71,12.16 180 top

### Tracks (layer width: path | path; a pad name or v marks a point on that pad's centre or on a via)
+3V3  (via drill 0.35)  (2 unrouted)
  Top 0.203: U9.2 49.64,2.6 48.6,2.6 48.4,2.4 | 48.4,2.4 48.4,2.2 | 48.4,2.2 48.4,1.6 48.12,1.32 U9.5 45.15,1.32 C18.1 | U9.6 48.17,1.97 48.4,2.2 | 48.4,2.4 48.4,3 48.13,3.27 U9.8 | R52.2 112.96,9.46 113.75,10.25 | R31.2 80.45,30.55 v80,31
  Top 0.305: 7.52,23.23 7.11,23.23 6.93,23.05 U1.15 6.93,20.2 5.02,18.3 U1.3 5.02,15.98 5.2,15.8 8,15.8 9,14.8 11.31,14.8 17.71,21.2 v22,21.2 | 7.52,23.23 7.72,23.23 | 7.72,23.23 7.92,23.23 8.2,22.96 U1.13 | U1.14 7.56,23.19 7.52,23.23 | C4.1 7.81,23.32 7.72,23.23 | U19.16 112.44,14 112.44,15.55 | R46.2 | R48.2 105.27,6.52 R50.2 105.3,11.85 | C28.1 180.12,14.93 U8.1 180.12,12.36 179.91,12.15 v174.83,12.15 | v165.59,12.14 165.59,4.67 164.92,4 U20.2
  Top 0.406: U4.2 48.56,11.37 C22.1 R9.2 52.63,11.37 53,11.74 53,20 | U6.10 91.97,16.36 93.11,17.5 v94.5,17.5 | 77.1,17.5 v77.1,17.51 | 92.5,11.7 92,11.2 v92,6 | v87.62,4.58 86.64,4.58 84.67,6.55
  Top 0.508: v24.6,23.4 25.2,24 25.2,29.42 25.25,29.48 | R40.1 R39.1 R38.1 R37.1 R36.1 R35.1 R34.1 R30.1 113.75,10.25 112.44,11.55 112.44,14 | U19.16 112.44,15.55 v112,16 | U6.16 99.59,15.6 101,17 v102.4,17 103,17 104.83,15.18 U19.10 104.83,12.18 105.15,11.85 105.3,11.85 C16.1 | C15.1 92.5,11.7 91.97,12.22 U6.10 | R2.2 R1.2 | C19.1 41.47,1.53 v39,4 | v39,15 39,17.4 40,18.4 46.84,18.4 R21.2 R20.2 51.37,18.37 53,20
  Top 0.703: 151,6 151,5 152,4 153.98,4 C25.1 156.83,4.02 U20.4
  Top 0.762: 30.68,31.03 28.81,31.03 27.25,29.48 R46.2 25.25,29.48 R1.2 | 30.68,31.03 38.97,31.03 40.87,29.13 C6.1 | 30.68,31.03 R3.2 30.7,29.62 R5.2 | C6.1 50.3,27.21 53.46,24.06 53.46,20.46 53,20 | C6.1 52.63,29.13 52.99,29.49 C5.1 54.36,30.46 54.83,30.93 U2.2 56.07,31 v58,31 | C19.1 C18.1 | v151,7 151,6 | U20.4 U20.2
  Bottom 0.305: v174.83,12.15 v165.6,12.15 v165.59,12.14
  Bottom 0.406: v92,6 90.58,4.58 v87.62,4.58 | v77.1,17.51 76.92,17.69 J4.P$1 76.92,30.92 77,31
  Bottom 0.508: v24.6,23.4 22.4,21.2 v22,21.2 | v39,4 v39,15
  Bottom 0.762: v58,31 77,31 v80,31 86,31 94,23 94,18 v94.5,17.5 95,17 v102.4,17 111,17 v112,16 114,14 150,14 151,13 v151,8 v151,7
+5V
  Top 0.305: C26.1 163.15,9
  Top 0.406: R33.2 162.45,16.45 162,16 | 175,29 176,29 176.3,28.7 R13.1
  Top 0.762: U20.3 163.15,9 163.15,12.85 162,14 162,16 J2.1
  Top 1.016: J2.1 167.4,26.4 169,28 171,28 C29.POS 173.77,27.77 175,29 175,31 176.15,32.15 C1.1 C3.1 181,28.48 L1.1
+200V
  Top 0.305: C34.1 196,8.18 195.76,7.94 R45.2
  Top 0.508: U10.6 116.73,19.86 117.59,19 122,19 | 122,19 126.5,19 | 126.5,19 131,19 | 131,19 135.5,19 | 135.5,19 140,19 | 140,19 144.5,19 | 144.5,19 149,19 | U11.6 121.23,19.77 122,19 | U12.6 125.73,19.77 126.5,19 | U13.6 130.23,19.77 131,19 | U14.6 134.73,19.77 135.5,19 | U15.6 139.23,19.77 140,19 | U16.6 143.73,19.77 144.5,19 | U17.6 148.23,19.77 149,19 | 149,19 153.01,19 R19.2
  Top 0.61: R19.2 152.94,35.94 155,38 191,38 196,33 196,23 | 196,23 C35.1 C34.1 | D1.K 195,24 196,23
ANODE1
  Top 0.305: R22.2 119,28 118,29 117,29 116,30 J3.13
ANODE2
  Top 0.305: J3.14 118,31 121,28 123,28 123.5,27.5 R23.2
ANODE3
  Top 0.305: J3.15 120,31 122,29 127,29 128,28 R24.2
ANODE4
  Top 0.305: J3.16 122,31 123,30 131,30 132.5,28.5 R25.2
ANODE5
  Top 0.305: J3.17 124,32 125,31 134,31 137,28 R26.2
ANODE6
  Top 0.305: R27.2 141.5,27.5 137,32 126.5,32 126,32.5 J3.18
ANODE7  (via drill 0.35)
  Top 0.305: J3.19 128.18,36 v140,36 | v146,29 R28.2
  Bottom 0.305: v140,36 144,36 146,34 v146,29
ANODE8
  Top 0.305: J3.20 146.18,33.83 150.5,29.5 R29.2
D2_N
  Top 0.152: U1.12 8.83,22.78 8.97,22.92 8.97,23.32 8.97,24.01 9.27,24.32 10.16,24.32 10.49,24.32 10.79,24.62 10.79,24.95 10.59,25.15 10.16,25.15 9.97,25.34 R17.2
D2_P
  Top 0.152: U1.11 9.47,22.77 9.32,22.92 9.32,23.86 9.42,23.96 10.64,23.96 11.15,24.47 11.15,24.95 11.35,25.15 11.79,25.15 12,25.37 R18.2
D_N
  Top 0.152: J1.D- 11.85,33.65 12.01,33.48 12.01,32.47 12.01,31.32 11.86,31.17 11.71,31.02 11.58,31.02 11.31,31.02 11.05,30.77 10.79,30.51 10.79,29.04 10.57,28.81 10.16,28.81 9.97,28.63 R17.1 C13.1
D_P
  Top 0.152: J1.D+ 12.5,33.62 12.37,33.48 12.37,31.18 11.86,30.66 11.45,30.66 11.15,30.36 11.15,29.04 11.38,28.81 11.79,28.81 11.99,28.61 11.99,27.86 R18.1 13.96,27.85 C14.1
DTR
  Top 0.203: Q3.E 6.15,11.39 5.49,12.06 5.49,13.89 4.89,14.48 R7.2 3.66,15.51 3.75,15.61 U1.1
EN  (via drill 0.3, 0.35)
  Top 0.203: R3.1 30.68,26.1 R4.2 30.77,24.11 C7.1 | Q2.C 4.57,8.79 v4.88,9.1 | v12.19,19.06 v12.19,21.09 | v29.06,24.75 29.26,24.75 30,24.01 C7.1 | U2.3 54.86,29.66 v54.2,29 | C7.1
  Bottom 0.203: v4.88,9.1 12.19,16.42 v12.19,19.06 | v54.2,29 52.4,27.2 42.6,27.2 42.58,27.18 31.49,27.18 v29.06,24.75 27.06,26.75 17.45,26.75 12.19,21.49 v12.19,21.09
ESP32_RX  (via drill 0.35)
  Top 0.203: U18.31 85.38,16.21 86.86,16.21 87.46,16.81 87.46,17.49 86.72,18.23 v83,18.23 76,18.23 U2.27
  Bottom 0.203: v83,18.23 84.54,19.77 J4.P$4
ESP32_TX
  Top 0.203: U18.30 86.16,15.85 87.01,15.85 87.82,16.66 87.82,18.18 86.49,19.5 82,19.5 | U2.28 82,19.5 | J4.P$3 82,19.5
FB  (via drill 0.35)
  Top 0.305: U3.3 v172.62,19.7 v172.63,19.7 | v179.48,9.88 v179.47,9.89 U8.5 | v179.48,9.88 R57.2 | v179.48,9.88 179.48,8.48 178.83,7.83 C24.1
  Bottom 0.305: v172.63,19.7 176.3,19.7 179.48,16.52 v179.48,9.88
GND  (via drill 0.35)  (234 unrouted)
  Top 0.203: U9.7 47.18,2.62 46.57,3.23 | 46.57,3.23 C18.2 | v20.6,23 21.3,22.3 21.4,22.3 | SW4.1 138,4.75 C17.1 140.3,1.3 140,1 | SW5.1 126.9,4.65 C20.1 129.3,1.3 129,1 | Q5.2 75.6,8.4 75.5,8.3 74.9,8.3 74.4,7.8 74.4,6 | C32.2 74.75,5.65 74.4,6 | C31.2 71.45,6.35 71.8,6 74.4,6 | U18.3 80.2,15.5 80.2,15.7 80.6,16.1 80.6,16.4 C23.2 | C2.2 86.69,6.93 86.69,7.15 86.95,7.41 86.95,7.62 U18.21 | 76.66,32.19 76.67,32.2 | U9.1 48.87,3.27 48.14,4 47.19,4 46.57,3.38 46.57,3.23 | SW3.1 148.25,1.25 148,1 | C21.1 118.09,1.09 118,1 | SW6.P1 SW6.P2 v81.75,26.7
  Top 0.254: 13.8,33 13.8,33.08 | 15.65,30.2 15.65,30.23 | J1.SHIELD@1 17.06,34.9 18.29,36.13 18.29,37.35 | LED3.C 18.94,39.01 18.29,38.36 18.29,37.35 | J1.SHIELD@3 18.19,37.25 18.29,37.35 | J1.SHIELD@2 7.12,34.9 | 7.12,34.9 6.71,35.31 6.71,36.94 7.02,37.25 J1.SHIELD@4 | C4.2 6.11,25.57 6.32,25.78 C13.2 | C13.2 6.32,34.1 7.12,34.9 | C13.2 4.42,27.84 3.9,28.37 R16.1
  Top 0.305: U1.16 6.29,22.83 6.1,23.03 6.1,24.03 C4.2 | C8.1 27.4,22.75 27.85,22.3 | C10.1 37.83,23.16 36.97,22.3 C7.2 27.85,22.3 | U1.6 6.93,17.93 7.4,18.4 8.8,18.4 10.2,19.8 10.2,22 13.2,25 13.86,25 15.65,23.2 | 15.65,23.2 16.56,22.3 21.4,22.3 27.85,22.3 | 15.65,23.2 C14.2 15.65,30.2 | 15.65,30.23 13.8,32.08 13.8,33 | 13.8,33.08 J1.GND | 13.8,33.08 15.24,33.08 15.6,33.44 J1.SHIELD@1 | 13.8,33.08 13.32,33.08 v13.2,33.2 | v7.4,34 7.12,34.28 7.12,34.9 | U6.8 90.7,24.7 92,26 | U19.8 103.56,18.45 105,17 107,17 108.64,15.37 U19.13 108.64,12.78 108.46,12.6 108.34,12.6 108.21,12.47 C16.2 | D3.A 152.95,11.05 v153,11 | v27.78,33.19 28.38,33.79 SW1.P1 SW1.P2 SW2.P1 SW2.P2 39.54,35.46 40,35 40,33 41.07,31.93 C6.2 | U18.3 81.6,14.1 81.6,13.6 81,13 80.43,13 U18.5 | C22.2 48.56,7.57 47,6 | 47,6 46,6 44.95,4.95 | 44.95,4.95 C18.2 | SP1.2 47,6 | 44.95,4.95 44.9,5 | U3.4 v173.31,18.43 | C28.2 178.29,14.31 178.39,14.21 179.32,14.21 179.47,14.06 U8.2 | C23.2 80.53,17.33 82.08,17.33 v82.1,17.35 | U6.13 95.78,12.69 95.6,12.5 95.5,12.5 95.35,12.35 C15.2 95.35,7.35 94,6 94,1
  Top 0.406: C18.2 C19.2 41.77,3.23 38,7 38,13 38.91,13.9 U4.5 | SP1.2 59.28,6 | C31.2 71.45,10.45 72.15,11.15 Q5.4 | C2.2 89,4.62 89,1 | C28.2 178.23,15 v176.26,15 | v176.26,15 U3.5 | R57.1 174.88,9.88 174.15,10.61 | 174.15,10.61 Q4.S | R12.1 v163,20 | v176.26,15 174.15,12.89 174.15,10.61 | C35.2 188,19 187,18 187,13 | J4.P$5 87.08,25.08 88,26
  Top 0.508: U2.15 59.28,12 | U5.8 100.89,25.89 101,26 | 101,26 92,26 88,26 v86.6,27.4 86.6,30.4 84.8,32.2 76.67,32.2 U2.38 | 101,26 102,26 | 102,26 113.35,26 113.69,25.66 U7.8 | v103.2,21.85 103.56,21.5 U19.8 | v102,24 102,26 | C24.2 176.27,3.27 176,3 | R12.1 164.06,22.06 165.97,23.97 C9.2 168.93,24.03 C12.2 | U3.4 164.56,18.43 164,19 164,19.95 R12.1 | C31.2 71.45,1.45 v71,1 | C32.2 75.6,1.6 75,1
  Top 0.61: C35.2 C34.2 187,13 181.96,13
  Top 0.703: C25.2 154,1.28 153.72,1 150,1
  Top 0.762: C6.2 50.53,32.16 C5.2 52.99,32.2 U2.1 61.6,32.2 65,28.8 | 65,28.8 U2.GND 65,20.8 63,18.8 61.05,18.8 | U2.38 68.4,32.2 65,28.8 | 61,18.8 61.05,18.8 | 61.05,18.8 59.28,17.04 U2.15 59.28,6 59.28,2.71 61,1 v71,1 75,1 89,1 94,1 118,1 129,1 140,1 148,1 150,1 | U20.1 166,1.7 | v167,1.7 174.7,1.7
  Top 0.813: R11.1 181.96,13 181.96,8.96 176,3 174.7,1.7 | C26.2 158.86,8.54 v158.7,8.7 | 171.65,33.85 C29.NEG
  Top 1.016: C3.2 C1.2 171.65,33.85 | C29.NEG 168.27,34.27 166.5,32.5 J2.2
  Bottom 0.203: v20.6,23 20.41,23.19 BATT1.N | v81.75,26.7 85.9,26.7 v86.6,27.4
  Bottom 0.305: v7.4,34 12.4,34 v13.2,33.2 v27.77,33.2 v27.78,33.19 | v173.31,18.43 176.26,15.48 v176.26,15 | v82.1,17.35 82.12,17.37 | 157.2,11 v153,11
  Bottom 0.406: v163,20 157.33,20 157.2,20.13 | 82.12,17.37 83.7,17.37 87.08,20.75 J4.P$5
  Bottom 0.508: v103.2,21.85 102,23.05 v102,24
  Bottom 1.016: J2.2 157.57,32.5 157.2,32.13 J2.3 157.2,20.13 157.2,11 157.2,10.2 v158.7,8.7 165.7,1.7 v167,1.7
  other vias: 59,23 59,22 68,29 59,28 59,30 61,30 62,32 66,32 69,32 66,29 63,29 40,24 38,24 36,24 36,22 38,22 40,22 34,22 44,31 46,31 30,33 32,33 21,25 23,25 23,23 1,24 1,22 1,20 5,6 2,6 6,31 8,31 5,35 6,35 6,39 18,36 15,33 92,27 95,27 98,27 103,25 107,26.5 112,26.5 124,6.5 135,6.5 146,6.5 16,22 15,22 12,24 14,26 13,25 5,26 6,26 7,26 4,27 3,24 3,19 1,8 61,23 61,22 102.5,20.1 102.5,18.1 80.7,12.59 81.38,13.32 70,2 72,2 71,3 73,3 72,4 74,2 73,1 74,2 85,1 83,1 81,1 79,1 77,1 55,2 69,3 59,26 60,26 60,28 61,25 59,25 65,29 68.28,19.99 69.28,20.99 75.71,25.51 78.02,25.51 78.61,27.59 85.02,25.51 87,25 89,25 89,23 89,21 85,27 90,31 88,31 90,29 89,30 109,8 108,7 115.02,7.54 117.06,7.56 124.03,3.96 135.03,3.96 146.03,3.96 159.03,22.96 157.03,22.96 155.03,22.96 155.03,20.96 157.03,20.96 159.03,20.96 159.03,18.96 157.03,18.96 157.03,16.96 159.03,16.96 159.03,14.96 157.03,14.96 164.03,23.96 166.03,23.96 164.03,21.96 166.03,21.96 171.03,24.96 174.03,25.96 173.03,24.96 173.03,20.96 164.03,14.96 166.03,14.96 168.03,14.96 176.03,16.96 185.03,19.96 187.03,19.96 187.03,17.96 185.03,17.96 185.03,15.96 187.03,15.96 185.03,13.96 187.03,13.96 185.03,11.96 187.03,11.96 183.03,13.96 183.03,11.96 184.03,12.96 186.03,12.96 186.03,14.96 184.03,14.96 186.03,16.96 186.03,18.96 182.03,7.96 184.03,7.96 186.03,7.96 186.03,5.96 185.03,6.96 183.03,6.96 187.03,4.96 187.03,6.96 188.03,5.96 189.03,4.96 185.03,4.96 171.03,6.96 171.03,4.96 171.03,2.96 167.03,3.96 167.03,5.96 167.03,7.96 45,10 45,9 44,9 43,9 52,10 54,14 55,14 55,13 54,13 58,15 54,16 60,8 63,8 63,6 60,6 60,4 63,4 63,2 60,2 14,31 17,30 18,32 94,7 95,7 96,7 97,7 101,8 103,8 105,22 105,26 110,26 155.03,24.96 157.03,24.96 159.03,24.96 155.03,26.96 155.03,28.96 155.03,30.96 155.03,32.96 157.03,32.96 157.03,34.96 159.03,34.96 161.03,34.96 163.03,34.96 165.03,34.96 165.03,29.96 163.03,29.96 161.03,29.96 159.03,29.96 159.03,27.96 165.03,27.96 168.03,30.96 170.03,30.96 172.03,30.96 163.92,17.39 166.74,17.38 168.48,17.38 172.4,18.41 171.03,8.96 188.03,10.96
  pour Bottom (isolate 0.4): -12,46 -12,-7 153,-7 204,-7 204,46
  pour Top (isolate 0.4): -13,46 -13,-7 204,-7 204,46
  cutout Top: 88,41 88,32 115,32 115,24 113,24 113,19 109,19 109,16 113,16 113,12 115,10 152,10 152,41
  cutout Top: 100,29 100,27 115,27 115,29
  cutout Top: 152,14 154,14 154,18 152,18
  cutout Top: 2,8 2,15 10,15 11,14 11,8
  cutout Top: 154,18 154,34 156,36 191,36 195,32 195,22 197,22 197,34 192,39 154,39 152,37 152,18
  cutout Top: 182,32 179,29 179,22 191,22 191,0 200,0 200,40 182,40
  cutout Bottom: 179,30.39 179,22 187.55,22 187.55,30.39
  cutout Top: 179,22 179,16 183,16 183,22
  cutout Bottom: 139,38 139,34 143,34 144,33 144,27 148,27 148,35 145,38
GPS_RX  (via drill 0.35)  (1 unrouted)
  Top 0.203: v51.77,7.92 55.1,11.25 v58,11.25 | v60.81,11.24 67.46,11.24
  Bottom 0.203: 51.73,7.96 v51.77,7.92 | v58,11.25 v60.8,11.25 v60.81,11.24
GPS_TX  (via drill 0.35)  (1 unrouted)
  Top 0.203: 69.54,12.47 67.73,10.66 v62.4,10.66 | v51.85,7.01 51.89,7.05 51.9,7.05 55.04,10.19 v57.22,10.19
  Bottom 0.203: v62.4,10.66 57.69,10.66 v57.22,10.19
IO0  (via drill 0.3, 0.35)
  Top 0.203: 34.26,29.64 R6.2 38.56,29.64 41.6,26.6 41.6,20.3 42.75,19.15 v45.2,19.15 | 34.26,29.64 R5.1 | Q3.C 8.18,8.74 v9.14,9.71 | v13.01,21.09 v13.01,19.06 | 34.26,29.64 34.26,25.58 v34.25,25.56 | v68.79,16.71 71.09,16.71 72.11,15.69 U2.25
  Bottom 0.203: v9.14,9.71 9.14,12.81 13.01,16.67 v13.01,19.06 | v13.01,21.09 13.01,21.69 17.52,26.2 26.8,26.2 28.9,24.1 32.79,24.1 v34.25,25.56 | v45.2,19.15 66.35,19.15 v68.79,16.71 v68.8,16.7
N$1
  Top 0.508: 114,28 115,27 115,19 116.76,17.24 R19.1 152.95,17.23 D3.K | U5.9 100.89,28.41 101.3,28 114,28 | U7.9 113.69,28.31 114,28
N$2
  Top 0.152: 1.19,30.01 1.22,30.03
  Top 0.203: U1.18 5.02,24.6 3.82,25.8 2.6,25.8 1.02,27.39 1.02,29.83 1.19,30.01 | R16.2 2,30.03 1.22,30.03
  Top 0.254: R16.2 R15.1
N$3
  Top 0.305: J3.1 92,33 U5.16
N$4  (via drill 0.35)
  Top 0.152: v23,39
  Top 0.203: LED1.C v23,39 | U1.17 5.66,21.34 v6,21 | v15.8,31.2 v18.6,34
  Bottom 0.203: v23,39 20.4,39 19.2,37.8 19.2,34.6 v18.6,34 | v15.8,31.2 8.8,24.2 8.8,21.4 8.4,21 v6,21
N$5  (via drill 0.35)
  Top 0.203: U1.10 9.47,15.73 9.8,15.4 10.2,15.4 11.35,16.55 v11.35,21.09 | LED2.C 21.4,39 20.8,38.4 20.8,28.8 20,28 v18,28
  Bottom 0.203: v18,28 18,27.9 11.35,21.25 v11.35,21.09
N$6  (via drill 0.3)
  Top 0.203: R4.1 28.86,26.23 C8.2 27.4,27.56 v27.38,27.57 | SW1.S2 SW1.S1 27.61,37.61 27.04,37.04 27.04,33 27.04,32.36 v27.36,32.04
  Bottom 0.203: v27.36,32.04 27.36,27.6 v27.38,27.57
N$7
  Top 0.203: R1.1 LED1.A
N$8
  Top 0.203: R2.1 LED2.A
N$9
  Top 0.203: Q2.B 3.66,10.86 R7.1
N$10
  Top 0.203: R8.1 7.18,12.71 7.18,11.79 7.32,11.65 7.92,11.65 8.05,11.52 Q3.B
N$11
  Top 0.203: U18.8 77.14,12.9 76.2,12.9 75.6,12.3 Q5.3 76.65,11.15 76.8,11 76.8,7.7 76.45,7.35 C32.1
N$12  (via drill 0.3)
  Top 0.203: C10.2 36.14,26.13 R6.1 37.73,27.94 v38.2,28.41 | v39.83,36.74 39.83,37.14 39.36,37.61 SW2.S2 SW2.S1
  Bottom 0.203: v38.2,28.41 39.83,30.03 v39.83,36.74
N$13
  Top 0.203: LED3.A R10.1
N$14
  Top 0.813: Q1.D 181,23.82 L1.2
  Top 1.016: L1.4 L1.2
N$15
  Top 0.406: C11.1 168.85,20.85 168.97,20.98 U3.2
N$16
  Top 0.305: U3.7 174.87,20.98 174.58,20.69 R14.2
N$17
  Top 0.203: U7.1 104.8,22.95 104.55,22.7 102.9,22.7 101.35,21.15 101.35,19.15 99.9,17.7 98.95,17.7 98.33,17.07 U6.15
N$18
  Top 1.016: L1.3 D1.A
N$19
  Top 0.406: Q1.G 180.01,19.7 U3.6
N$20  (via drill 0.35)
  Top 0.203: C9.1 168.9,22.25 U3.1 v172.06,22.25 v172.07,22.24 | v180.65,17.6 180.67,17.62 R11.2
  Top 0.813: R11.2 Q1.S
  Bottom 0.203: v172.07,22.24 175.49,22.24 180.13,17.6 v180.65,17.6
N$21
  Top 0.406: R12.2 C11.2
N$22
  Top 0.203: U5.7 99.62,20 U6.1
N$23
  Top 0.406: U3.8 176.26,23.99 C12.1 R13.2
N$24
  Top 0.305: R33.1 172,16.45 | 172,16.45 R14.1 | Q4.D 171.43,15.88 172,16.45
N$25
  Top 0.203: U5.6 98.35,20 U6.2
N$26
  Top 0.203: U5.5 97.06,24.27 U6.3
N$27
  Top 0.203: U18.7 77.71,13.47 75.67,13.47 74.5,12.3 74.5,9.6 74.15,9.25 Q5.1 73.15,9.2 C31.1
N$28
  Top 0.305: R22.1 119.27,23.43 U10.4
N$29
  Top 0.305: U11.4 123.77,23.43 R23.1
N$30
  Top 0.305: U12.4 128.27,23.43 R24.1
N$31
  Top 0.305: U13.4 132.77,23.43 R25.1
N$32
  Top 0.305: U14.4 137.27,23.43 R26.1
N$33
  Top 0.305: U15.4 141.77,23.43 R27.1
N$34
  Top 0.305: U16.4 146.27,23.43 R28.1
N$35
  Top 0.305: U17.4 150.77,23.43 R29.1
N$36
  Top 0.203: R30.2 116.7,15.32 U10.1
N$37
  Top 0.406: SP1.1 68.44,6 69,6.56 R32.1
N$38  (via drill 0.35)
  Top 0.203: U10.3 119.27,13.25 v118.5,12.48 | v86.22,17 85.04,17 U18.32
  Bottom 0.203: v118.5,12.48 118.48,12.48 118.26,12.26 90.96,12.26 v86.22,17
N$39
  Top 0.305: R44.2 Q4.G
N$40
  Top 0.203: U6.4 95.81,20 U5.4
N$41
  Top 0.203: U5.3 94.54,20 U6.5
N$42
  Top 0.203: U6.6 93.25,24.27 U5.2
N$43
  Top 0.203: U5.1 91.97,24.27 U6.7
N$44  (via drill 0.35)
  Top 0.203: U6.9 90.7,15.71 v91,16 | U19.14 109.9,15.7 109.8,15.8 v109.3,15.8
  Bottom 0.203: v109.3,15.8 109.1,15.8 108.7,15.4 91.9,15.4 91.34,15.96 91.04,15.96 v91,16
N$45
  Top 0.203: U19.15 111.17,16.77 113.45,19.05 113.45,22.25 112.42,23.28 U7.7
N$46
  Top 0.203: U7.4 108.61,22.64 108.85,22.4 112.05,22.4 112.45,22 112.44,22 U19.1
N$47
  Top 0.203: U7.3 107.34,22.51 107.9,21.95 110.85,21.95 111.17,21.62 U19.2
N$48
  Top 0.203: U7.2 106.07,22.03 106.55,21.55 108.35,21.55 109.65,21.55 109.91,21.3 U19.3
N$49  (via drill 0.35)
  Top 0.305: U8.6 180.12,10.37 v180.61,9.88 | v188.59,7.93 R41.1
  Bottom 0.305: v180.61,9.88 186.64,9.88 v188.59,7.93
N$50  (via drill 0.35)
  Top 0.203: U2.8 v57.62,23.31 | v43.42,26.19 43.42,27.61 v43,28.03 | v41,31 38.58,33.42 34.18,33.42 v33.46,34.14 | v27,39 LED6.C | LED6.C
  Bottom 0.203: v43.42,26.19 44.05,25.56 49.06,25.56 51.31,23.31 v57.62,23.31 | v43,28.03 41,30.03 v41,31 | v33.46,34.14 33.46,38.28 32.74,39 v27,39
N$51
  Top 0.203: U11.1 121.23,11.98 R34.2
N$52
  Top 0.203: U12.1 125.73,11.98 R35.2
N$53
  Top 0.203: U13.1 130.23,11.98 R36.2
N$54
  Top 0.203: U14.1 134.73,11.98 R37.2
N$55
  Top 0.203: U15.1 139.23,11.98 R38.2
N$56
  Top 0.203: U16.1 143.73,11.98 R39.2
N$57
  Top 0.203: U17.1 148.23,11.98 R40.2
N$58  (via drill 0.35)
  Top 0.203: v122.9,12.4 123.77,13.27 U11.3 | U18.1 84.98,12.98 v85.01,12.98
  Bottom 0.203: v122.9,12.4 122.4,11.9 87.39,11.9 86.54,12.74 85.25,12.74 v85.01,12.98
N$59  (via drill 0.35)
  Top 0.203: v127.6,12.5 128.27,13.17 U12.3 | v84.3,12.5 81.38,15.42 U18.2
  Bottom 0.203: v127.6,12.5 126.6,11.5 87.02,11.5 86.31,12.21 84.59,12.21 v84.3,12.5
N$60  (via drill 0.35)
  Top 0.203: v131.9,12.4 132.77,13.27 U13.3 | v83.59,11.64 79.68,11.64 U18.9
  Bottom 0.203: v131.9,12.4 130.6,11.1 86.77,11.1 86.23,11.64 v83.59,11.64
N$61  (via drill 0.35)
  Top 0.203: v136.5,12.4 137.27,13.17 U14.3 | U18.10 80.23,11.06 v84.23,11.06
  Bottom 0.203: v136.5,12.4 134.8,10.7 86.56,10.7 86.2,11.06 v84.23,11.06
N$62  (via drill 0.35)
  Top 0.203: v140.9,12.3 141.77,13.17 U15.3 | U18.11 80.78,10.48 v84.87,10.48
  Bottom 0.203: v140.9,12.3 138.9,10.3 86.35,10.3 86.17,10.48 v84.87,10.48
N$63  (via drill 0.35)
  Top 0.203: v145.5,12.3 146.27,13.07 U16.3 | v85.52,9.9 81.33,9.9 U18.12
  Bottom 0.203: v145.5,12.3 143.1,9.9 v85.52,9.9
N$64  (via drill 0.35)
  Top 0.203: U17.3 150.77,12.77 v150,12 | U18.13 81.88,9.32 v84.29,9.32
  Bottom 0.203: v150,12 147.54,9.54 86.56,9.54 86.34,9.32 v84.29,9.32
N$65
  Top 0.305: J3.2 94,32.15 93.27,31.42 U5.15
N$66
  Top 0.305: U5.14 94.54,31.24 96,32.7 J3.3
N$67
  Top 0.305: J3.4 98,32.55 97.25,31.8 96.5,31.8 95.81,31.11 U5.13
N$68
  Top 0.305: U5.12 97.08,30.63 100,33.55 J3.5
N$69
  Top 0.305: U5.11 98.35,30.85 101.33,33.83 J3.6
N$70
  Top 0.305: J3.7 104.05,36.12 104.05,32.7 103.3,31.95 100.75,31.95 99.62,30.82 U5.10
N$71
  Top 0.305: J3.8 105.22,33.83 104.8,33.4 U7.16
N$72
  Top 0.305: U7.15 106.07,31.67 108,33.6 J3.9
N$73
  Top 0.305: J3.10 109.22,33.83 107.34,31.94 U7.14
N$74
  Top 0.305: R42.2 110.55,32.25 112,33.7 J3.11
N$75
  Top 0.305: J3.12 114.05,33.77 R43.2
N$76
  Top 0.305: R41.2 R45.1
  Top 0.406: R45.1
N$77
  Top 0.203: C30.1 79.46,24.44 J4.P$2
N$78  (1 unrouted)
N$79
  Top 0.305: U7.13 108.61,31.26 R42.1
N$80
  Top 0.305: U7.10 112.42,31.43 R43.1
N$81  (2 unrouted)
  Top 0.203: 78.9,15.67 C23.1
  Top 0.406: U18.6 77.99,14.31 77.99,14.67 78.9,15.58 | 78.9,15.58 78.9,15.67 | U18.4 78.99,15.58 78.9,15.58
N$82  (1 unrouted)
N$83  (1 unrouted)
N$86  (via drill 0.35)
  Top 0.203: R49.1 110,4.8 v110.4,5.2 | v129.2,7.7 129.3,7.6 C20.2
  Top 0.254: C20.2 130.05,6.35 132.4,4 SW4.2
  Bottom 0.203: v110.4,5.2 113.9,8.7 128.2,8.7 v129.2,7.7
N$87  (via drill 0.35)
  Top 0.203: C17.2 140.3,8 v139.7,8.6 | v103.8,4.8 103.77,4.77 R47.1
  Top 0.254: C17.2 141.05,6.45 143.5,4 SW3.2
  Bottom 0.203: v139.7,8.6 139.2,9.1 112.6,9.1 108.3,4.8 v103.8,4.8
N$90
  Top 0.254: C21.2 118.11,6 | 118.11,6 119.18,6 121.18,4 SW5.2 | R51.1 118.11,6
N$94
  Top 0.203: R46.1 LED6.A
RCK  (via drill 0.35)
  Top 0.203: v94.5,8.89 94.5,13.82 U6.12 | U19.12 107.36,9.29 v106.97,8.9 | U18.16 82.96,7 v83,7
  Bottom 0.203: v106.97,8.9 94.52,8.9 v94.5,8.89 v94.5,8.9 84.9,8.9 v83,7
RST
  Top 0.203: U18.29 85.75,14.34 86.84,15.43 87.32,15.43 88.45,16.56 88.45,18.42 86.8,20.07 86.08,20.07 85.81,20.34 85.81,23.19 84.54,24.46 | C30.2 84.54,24.46 | SW6.S1 SW6.S2 R31.1 82.82,26.18 84.54,24.46
RTS
  Top 0.203: Q2.E 1.68,16.99 2.44,17.75 4.06,17.75 4.39,17.42 U1.2 4.39,15.8 4.82,15.36 6.91,15.36 7.11,15.16 R8.2
RXD  (via drill 0.3, 0.35)
  Top 0.203: U1.4 5.66,18.21 7.11,19.67 v7.92,19.67 | v69.14,28.01 v69.14,28.02 69.51,28.39 U2.35
  Bottom 0.203: v69.14,28.01 69.14,22.25 66.66,19.77 10.45,19.77 10.35,19.67 v7.92,19.67
SCK  (via drill 0.35)
  Top 0.203: U6.11 93.25,15.24 v94,16 | U19.11 106.09,15.21 v105.3,16 | U18.15 83,8.17 v83,8.2
  Bottom 0.203: v105.3,16 v94,16 92.18,16 90.58,17.6 v89.19,17.6 85.9,17.6 83,14.7 v83,8.2
SCL  (via drill 0.35)
  Top 0.203: v42,8 41.3,8.7 U4.8 43.29,10.09 45.55,12.35 45.55,14.83 45.97,15.25 48.41,15.25 48.92,15.76 R20.1 | v53,5 53,2 52.32,1.32 U9.4 | U2.36 71.16,29.66 v70.74,29.24 | v70.74,25.44 70.74,20.93 66.19,16.38 v61.39,16.38
  Bottom 0.203: v42,8 45,5 v53,5 53,7.99 v61.39,16.38 | v70.74,29.24 v70.74,25.44
SCL_AT  (via drill 0.35)
  Top 0.203: U18.28 86.98,14.41 88.66,14.41 89.93,13.14 89.93,3.34 v91.04,2.23 v91.04,2.22 | U8.3 v176.38,13.31 | v159.03,13.31 v155.52,9.8
  Bottom 0.203: v91.04,2.22 91.04,2.2 91.47,1.77 151.14,1.77 151.64,2.27 151.64,5.92 v155.52,9.8 | v176.38,13.31 v159.03,13.31
SDA  (via drill 0.35)
  Top 0.203: v42,7 40,9 40,11 40.37,11.37 U4.7 43.37,11.37 45,13 45,16 45.67,16.67 R21.1 | v51.74,4.42 51.74,2.74 50.97,1.97 U9.3 | U2.33 72.21,25.85 71.68,25.32 71.68,20.68 66.59,15.59 v62.98,15.59
  Bottom 0.203: v42,7 44.58,4.42 v51.74,4.42 52.01,4.42 52.6,3.83 53.47,3.83 53.94,4.3 53.94,8.08 61.45,15.59 v62.98,15.59
SDA_AT  (via drill 0.35)
  Top 0.203: U18.27 87.64,13.94 88.27,13.94 89.45,12.76 89.45,4.82 89.46,4.81 89.46,2.43 v90.03,1.86 | v158.59,11.11 158.11,11.11 v156,9 | v176.41,11.11 U8.4
  Bottom 0.203: v90.03,1.86 v90.04,1.86 90.6,1.3 151.3,1.3 152,2 152,5 v156,9 | v176.41,11.11 v158.59,11.11
SER  (via drill 0.35)
  Top 0.203: U6.14 97.06,16.34 95.1,18.3 v92,18.3 | v82.29,8.71 82.29,8.59 U18.14
  Bottom 0.203: v92,18.3 86,18.3 82.29,14.59 v82.29,8.71
SPEAKER
  Top 0.406: U2.26 74.04,16.92 75.38,16.92 75.96,16.34 75.96,14.83 75.25,14.12 73.18,14.12 70.59,11.53 70.59,10.19 70.25,9.85 R32.2
SQW  (via drill 0.35)
  Top 0.203: U4.3 48.63,12.63 49.07,13.07 R9.1 v50.6,16.99 v50.61,17 | v53.95,18.47 54.43,18.95 54.43,25.42 54.86,25.85 U2.6
  Bottom 0.203: v50.61,17 52.08,18.47 v53.95,18.47
SW3  (via drill 0.35)
  Top 0.203: R47.2 100.74,4.82 R48.1 95.72,4.82 v95.7,4.8 | U2.11 57.5,19.5 58.48,18.52 v59,18.52
  Bottom 0.203: v95.7,4.8 94.81,3.91 80.45,3.91 65.84,18.52 v59,18.52
SW4  (via drill 0.35)
  Top 0.203: R49.2 107,4.85 R50.1 105.3,3.7 105,3.4 v104.1,3.4 | U2.12 v57.43,18.23 v57.44,18.22
  Bottom 0.203: v104.1,3.4 104.04,3.34 79.96,3.34 65.42,17.88 57.78,17.88 v57.44,18.22
SW5  (via drill 0.35)
  Top 0.203: R52.1 112.96,5.36 v111.6,4 | v57.56,16.96 U2.13
  Top 0.254: R52.1 112.98,6 R51.2
  Bottom 0.203: v111.6,4 110.4,2.8 78.4,2.8 64.24,16.96 v57.56,16.96
TXD  (via drill 0.3, 0.35)
  Top 0.203: U1.20 3.75,20.59 4.06,20.28 v4.88,20.28 | v68.51,26.7 69.13,27.32 73.8,27.32 U2.34
  Bottom 0.203: v4.88,20.28 66.45,20.28 68.53,22.36 68.53,26.68 v68.51,26.7
UC_EN  (via drill 0.35)  (1 unrouted)
  Top 0.305: R44.1 v168.71,4.3 | v88,2 84.06,5.95
  Bottom 0.305: v88,2 88.22,2 89.6,0.62 167.62,0.62 168.71,1.71 v168.71,4.3
VBATT  (via drill 0.35)
  Top 0.203: U4.6 43.63,12.63 44,13 44,16 v43,17 | v41,19.13 v41,22
  Bottom 0.203: v43,17 41,19 v41,19.13 | v41,22 42.19,23.19 BATT1.P
VBUS  (via drill 0.3)
  Top 0.203: v7.11,32.67 v11.33,32.67 11.2,32.8 J1.VCC | v5.49,32.67 4.47,32.67 3.66,33.48 2.07,33.48 R15.2 | v18.69,29.62 18.83,29.48 R10.2
  Bottom 0.203: v7.11,32.67 v5.49,32.67 | v18.69,29.62 16.26,32.06 11.94,32.06 v11.33,32.67

### Text on the board
tPlace: IO0 | EN | Nostalgy | Designed by Kinoshita(@_nosita) | nixie tube drive board rev.3